# EasyEDA Pro project ProDoc_发射端.epro

# Schematic Main

## Sheets
1 P2: Board Name: 发射端; Create Date: 2025-08-19; Page Name: P2; Project Name: thu硬设魔杖; Schematic Name: Main; Update Date: 2025-08-24; Company: 嘉立创EDA; Page Size: A4; Version: V1.0
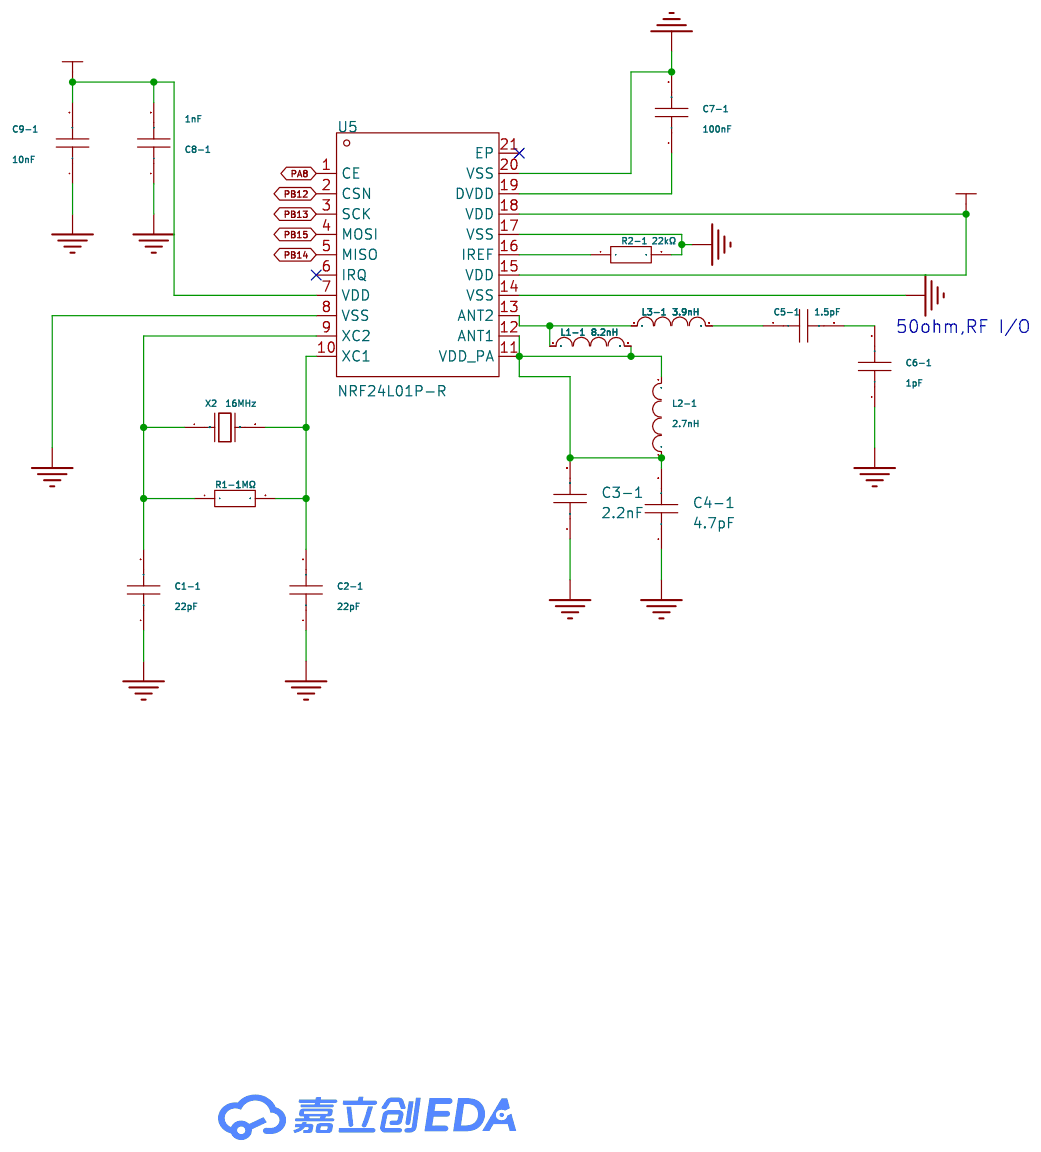
[diagram p0: P2]
2 P3: Board Name: Main; Create Date: 2025-08-20; Page Name: P3; Update Date: 2025-08-22
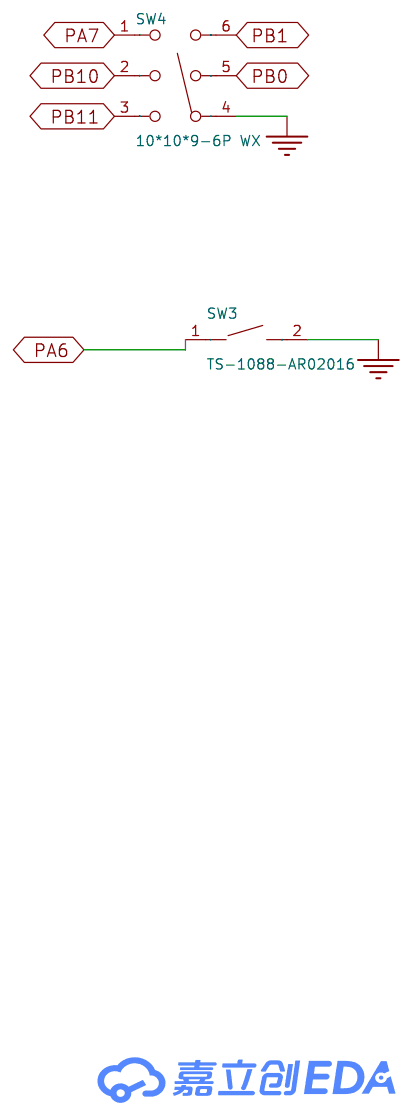
[diagram p1: P3]
3 P1: Create Date: 2025-08-20; Page Name: P1; Update Date: 2025-08-29
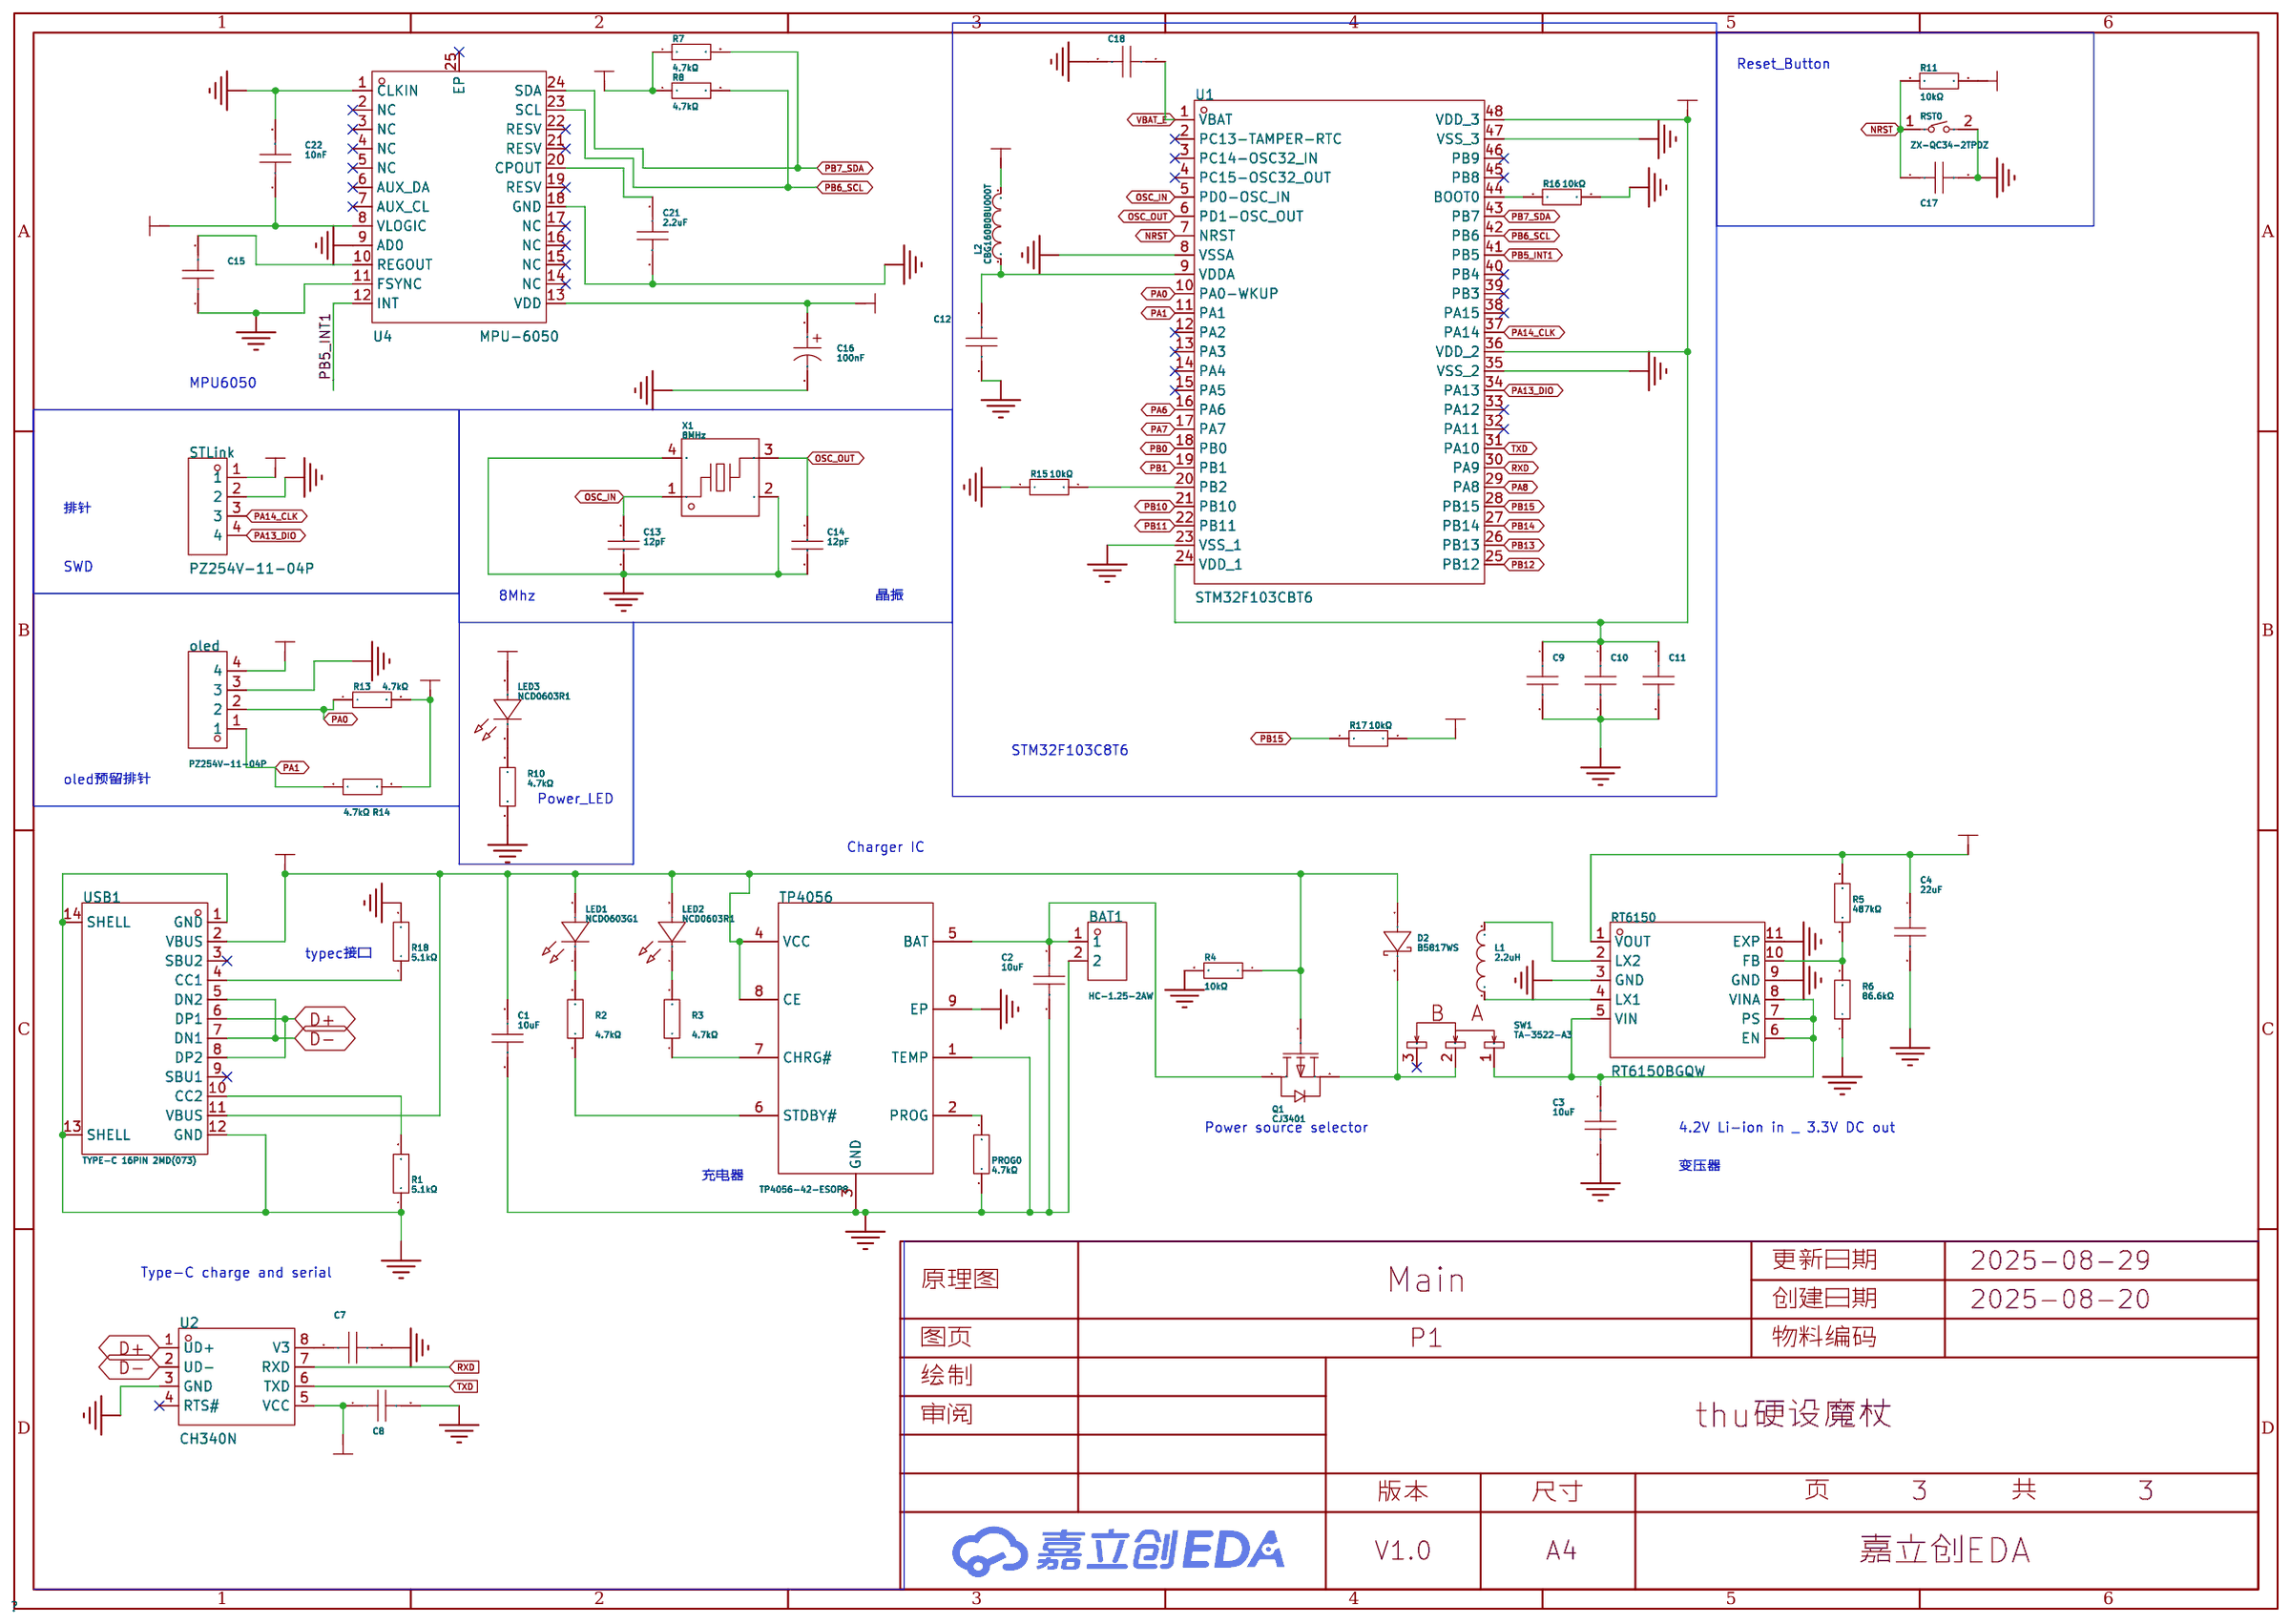
[diagram p2: P1]

## Parts
sheet P1
BAT1  HC-1.25-2AW  [CONN-TH_2P-P1.25_HCTL_HC-1.25-2AW]
C1  10uF  [C0603]
C2  10uF  [C0603]
C3  10uF  [C0603]
C4  22uF  [C0603]
C7  100nF  [C0603]
C8  100nF  [C0603]
C9  100nF  [C0603]
C10  100nF  [C0603]
C11  100nF  [C0603]
C12  100nF  [C0603]
C13  12pF  [C0603]
C14  12pF  [C0603]
C15  100nF  [C0603]
C16  100nF  [C0603]
C17  100nF  [C0603]
C18  100nF  [C0603]
C21  2.2uF  [C0603]
C22  10nF  [C0603]
D2  B5817WS  [SOD-323_L1.7-W1.3-LS2.5-FD]
L1  2.2uH  [L0603]
L2  CBG160808U000T  [L0603]
LED1  NCD0603G1  [LED0603-RD_1]
LED2  NCD0603R1  [LED0603-RD_RED]
LED3  NCD0603R1  [LED0603-RD_RED]
oled  PZ254V-11-04P  [HDR-TH_4P-P2.54-V-M]
PROG0  4.7kΩ  [R0603]
Q1  CJ3401  [SOT-23-3_L2.9-W1.6-P1.90-LS2.8-BR]
R1  5.1kΩ  [R0603]
R2  4.7kΩ  [R0603]
R3  4.7kΩ  [R0603]
R4  10kΩ  [R0603]
R5  487kΩ  [R0603]
R6  86.6kΩ  [R0603]
R7  4.7kΩ  [R0603]
R8  4.7kΩ  [R0603]
R10  4.7kΩ  [R0603]
R11  10kΩ  [R0603]
R13  4.7kΩ  [R0603]
R14  4.7kΩ  [R0603]
R15  10kΩ  [R0603]
R16  10kΩ  [R0603]
R17  10kΩ  [R0603]
R18  5.1kΩ  [R0603]
RST0  ZX-QC34-2TPDZ  [KEY-SMD_L3.9-W3.0-LS5.0-EH]
RT6150  RT6150BGQW  [WSON-10_L2.5-W2.5-P0.50-BL-EP]
STLink  PZ254V-11-04P  [HDR-TH_4P-P2.54-V-M]
SW1  TA-3522-A3  [SW-TH_3P-L9.1-W3.5-P2.50-A3]
TP4056  TP4056-42-ESOP8  [ESOP-8_L4.9-W3.9-P1.27-LS6.0-BL-EP]
U1  STM32F103CBT6  [LQFP-48_L7.0-W7.0-P0.50-LS9.0-BL]
U2  CH340N  [SOP-8_L4.9-W3.9-P1.27-LS6.0-BL]
U4  MPU-6050  [QFN-24_L4.0-W4.0-P0.50-BL-EP2.7]
USB1  TYPE-C 16PIN 2MD(073)  [USB-C-SMD_TYPE-C-6PIN-2MD-073]
X1  8MHz  [CRYSTAL-SMD_4P-L3.2-W2.5-BL]
sheet P2
C1-1  22pF  [C0603]
C2-1  22pF  [C0603]
C3-1  2.2nF  [C0603]
C4-1  4.7pF  [C0603]
C5-1  1.5pF  [C0603]
C6-1  1pF  [C0603]
C7-1  100nF  [C0603]
C8-1  1nF  [C0603]
C9-1  10nF  [C0603]
L1-1  8.2nH  [L0603]
L2-1  2.7nH  [L0603]
L3-1  3.9nH  [L0603]
R1-1  1MΩ  [R0603]
R2-1  22kΩ  [R0603]
U5  NRF24L01P-R  [QFN-20_L4.0-W4.0-P0.50-BL-EP]
X2  16MHz  [OSC-TH_L10.0-W4.5-P5.00]
sheet P3
SW3  TS-1088-AR02016  [SW-SMD_L3.9-W3.0-P4.45]
SW4  10*10*9-6P WX  [SW-SMD-6P-L10.5-W10.0_C2858290]

## Library data of the parts
BAT1 = HC-1.25-2AW: 插针结构:1x2P;间距:1.25mm;安装方式:弯插;参考系列:-;总PIN数:2P;排数:1;每排PIN数:2;行距:-;额定电流:1A;触头材质:黄铜;触头镀层:锡;工作温度范围:-25℃~+85℃;; LCSC Part Name: 1x2P 间距:1.25mm 弯插; Supplier Part: C2845535; Manufacturer: HCTL(华灿天禄); Supplier Footprint: 弯插,P=1.25mm; JLCPCB Part Class: 扩展库; Datasheet: https://atta.szlcsc.com/upload/public/pdf/source/20230707/04F6BEA69F699E7BB6558EF06AF1DC24.pdf; Supplier: LCSC; Pins Structure: 1x2P; Pitch: 1.25mm; Mounting Style: 弯插; Number of Pins: 2P; Number of Rows: 1; Number of PINs Per Row: 2; Current Rating (Max): 1A; Contact Material: 黄铜; Contact Plating: 锡; Operating Temperature Range: -25℃~+85℃
C1-C3 = CL10A106KP8NNNC: 容值:10uF;精度:±10%;额定电压:10V;温度系数:X5R;; LCSC Part Name: 10uF ±10% 10V; Supplier Part: C19702; Manufacturer: SAMSUNG(三星); Supplier Footprint: 0603; JLCPCB Part Class: Basic Part; Datasheet: https://item.szlcsc.com/datasheet/CL10A106KP8NNNC/20411.html; Supplier: LCSC; Tolerance: ±10%; Voltage Rating: 10V; Temperature Coefficient: X5R
C4 = CL10A226MO7JZNC: 容值:22uF;精度:±20%;额定电压:16V;温度系数:X5R;; LCSC Part Name: 22uF ±20% 16V; Supplier Part: C2762594; Manufacturer: SAMSUNG(三星); Supplier Footprint: 0603; JLCPCB Part Class: Extended Part; Datasheet: https://item.szlcsc.com/datasheet/CL10A226MO7JZNC/2889856.html; Supplier: LCSC; Tolerance: ±20%; Voltage Rating: 16V; Temperature Coefficient: X5R
C7-C12 C15 C17 C18 = CT41G-0603-2X1-50V-0.1μF-K(N): 容值:100nF;精度:±10%;额定电压:50V;温度系数:-;; LCSC Part Name: 100nF ±10% 50V; Supplier Part: C125205; Manufacturer: TORCH(火炬); Supplier Footprint: 0603; JLCPCB Part Class: Extended Part; Datasheet: https://atta.szlcsc.com/upload/public/pdf/source/20171225/C150708_15141883600121203188.pdf; Supplier: LCSC; Tolerance: ±10%; Voltage Rating: 50V
C13 C14 = CL10C120JB8NNNC: 容值:12pF;精度:±5%;额定电压:50V;温度系数:C0G;; LCSC Part Name: 12pF ±5% 50V; Supplier Part: C38523; Manufacturer: SAMSUNG(三星); Supplier Footprint: 0603; JLCPCB Part Class: Basic Part; Datasheet: https://item.szlcsc.com/datasheet/CL10C120JB8NNNC/39506.html; Supplier: LCSC; Tolerance: ±5%; Voltage Rating: 50V; Temperature Coefficient: C0G
C7-1 C16 = CGA0603X7R104K500JT: 容值:100nF;精度:±10%;额定电压:50V;温度系数:X7R;; LCSC Part Name: 100nF ±10% 50V; Supplier Part: C6119867; Manufacturer: HRE(芯声); Supplier Footprint: 0603; JLCPCB Part Class: Extended Part; Datasheet: https://atta.szlcsc.com/upload/public/pdf/source/20250103/C44077DA9E7B3EFAE02F22B6D3D1CBC9.pdf; Supplier: LCSC; Tolerance: ±10%; Voltage Rating: 50V; Temperature Coefficient: X7R
C21 = CL10A225KO8NNNC: 容值:2.2uF;精度:±10%;额定电压:16V;材质(温度系数):X5R;; LCSC Part Name: 2.2uF ±10% 16V; Supplier Part: C23630; Manufacturer: SAMSUNG(三星); Supplier Footprint: 0603; JLCPCB Part Class: Basic Part; Datasheet: https://atta.szlcsc.com/upload/public/pdf/source/20160218/1457707763339.pdf; Supplier: LCSC; Tolerance: ±10%; Voltage Rated: 16V; Temperature Coefficient: X5R
C22 = CC0603KRX7R9BB103: 容值:10nF;精度:±10%;额定电压:50V;材质(温度系数):X7R;; LCSC Part Name: 10nF ±10% 50V; Supplier Part: C100042; Manufacturer: YAGEO(国巨); Supplier Footprint: 0603; JLCPCB Part Class: Extended Part; Datasheet: https://atta.szlcsc.com/upload/public/pdf/source/20181008/C309510_22F155564471FAF6A489F7D68F34234E.pdf; Supplier: LCSC; Tolerance: ±10%; Voltage Rated: 50V; Temperature Coefficient: X7R
D2 = B5817WS_C7420329: 二极管配置:独立式;正向压降(Vf):450mV@1.0A;直流反向耐压(Vr):20V;整流电流:1A;; LCSC Part Name: 电压:20V 电流:1A; Supplier Part: C7420329; Manufacturer: 宏嘉诚; Supplier Footprint: SOD-323; JLCPCB Part Class: Extended Part; Datasheet: https://item.szlcsc.com/datasheet/B5817WS/8397151.html; Supplier: LCSC; Diode Configuration: 独立式; Forward Voltage (Vf@If): 450mV@1.0A; Reverse Voltage (Vr): 20V; Average Rectified Current (Io): 1A; Reverse Leakage Current (Ir): 1mA@20V; Voltage - Forward(Vf@If): 450mV@1.0A; Voltage - DC Reverse(Vr): 20V; Current - Rectified: 1A; Operating Junction Temperature Range: -55℃~+150℃; Non-Repetitive Peak Forward Surge Current: 10A
L1 = CMH160808B2R2MT: 电感值:2.2uH;精度:±20%;额定电流:750mA;; LCSC Part Name: 2.2uH ±20%; Supplier Part: C394950; Manufacturer: FH(风华); Supplier Footprint: 0603; JLCPCB Part Class: Extended Part; Datasheet: https://atta.szlcsc.com/upload/public/pdf/source/20230223/142B566F7A79878A07A1E031813F1064.pdf; Supplier: LCSC; Tolerance: ±20%; Current Rating: 750mA; DC Resistance(DCR): 240mΩ; Ratings: AEC-Q200
L2 = CBG160808U000T: 标称阻抗@测试频率:0Ω@100MHz;直流电阻(RDC):100mΩ;; LCSC Part Name: 单路 0603磁珠 阻抗0Ω@100MHz; Supplier Part: C43163; Manufacturer: FH(风华); Supplier Footprint: 0603; JLCPCB Part Class: 扩展库; Datasheet: https://atta.szlcsc.com/upload/public/pdf/source/20190129/C361667_1614D407CC98D1D3CFBD9E1F7511C14D.pdf; Supplier: LCSC; Impedance @ Frequency: 0Ω@100MHz; DC Resistance: 100mΩ; Current Rating: 800mA; Circuits: 1
LED1 = NCD0603G1: 发光颜色:翠绿色;正向压降(Vf):2.6V~3.6V;功率:72mW;正向电流:20mA;波长:515nm~530nm;透镜颜色:-;发光强度:330mcd~900mcd;发光角度:130°;工作温度:-30℃~+85℃;; Supplier Part: C84267; Manufacturer: 国星光电; Supplier Footprint: 0603; JLCPCB Part Class: Extended Part; Datasheet: https://item.szlcsc.com/datasheet/NCD0603G1/85436.html; Supplier: LCSC; Illumination Color: 翠绿色; Voltage - Forward(Vf): 2.6V~3.6V; Power(Watts): 72mW; Forward Current: 20mA; Wavelength - Dominant: 515nm~530nm; Luminous Intensity: 330mcd~900mcd; Viewing Angle: 130°; Operating Temperature: -30℃~+85℃
LED2 LED3 = NCD0603R1_C84263: 灯头类型:-;发光颜色:红色;正向电压(VF):1.6V~2.6V;功率:65mW;正向电流:20mA;主波长:615nm~630nm;二极管配置:独立二极管;透镜颜色:无色透明透镜;色温:-;发光强度:80mcd~220mcd;发光角度:130°;载带方式:-;工作温度:-30℃~+85℃;; Supplier Part: C84263; Manufacturer: 国星光电; Supplier Footprint: 0603; JLCPCB Part Class: Extended Part; Datasheet: https://atta.szlcsc.com/upload/public/pdf/source/20200820/C84263_DABC6A75E58F576973B407FDBA283D60.pdf; Supplier: LCSC; Emitted Color: 红色; Forward Voltage (VF): 1.6V~2.6V; Power Dissipation: 65mW; Forward Current: 20mA; Dominant Wavelength: 615nm~630nm; Diode Configuration: 独立二极管; Lens Color: 无色透明透镜; Luminous Intensity: 80mcd~220mcd; Viewing Angle: 130°; Operating Temperature: -30℃~+85℃
oled STLink = PZ254V-11-04P: 插针结构:1x4P;间距:2.54mm;行距:-;圆针/方针:方针;安装类型:直插;排数:单排;总PIN位数:4P;额定电流:3A;额定电压:250V;配合针长度:6mm;塑高:2.5mm;端接针长度:3mm;触头材质:-;工作温度范围:-40℃~+105℃;颜色:黑色;; LCSC Part Name: 间距:2.54mm 1x4P 直插 方针; Supplier Part: C2691448; Manufacturer: XFCN(兴飞); Supplier Footprint: 插件,P=2.54mm; JLCPCB Part Class: 扩展库; Datasheet: https://atta.szlcsc.com/upload/public/pdf/source/20200309/C492403_F9F19131791D08044AD4F84F8E751A34.pdf; Supplier: LCSC; Pin Structure: 1x4P; Pitch: 2.54mm; Circluar Pins/Square Pins: 方针; Mounting Type: 直插; Number of Rows: 单排; Number of Pins: 4P; Current Rating (Max): 3A; Voltage Rating (Max): 250V; Length of Mating Pin: 6mm; Insulation Height: 2.5mm; Length of End Connection Pin: 3mm; Operating Temperature Range: -40℃~+105℃; Color: 黑色
PROG0 R2 R3 R7 R8 R10 R13 R14 = 0603WAF4701T5E: 电阻类型:厚膜电阻;阻值:4.7kΩ;精度:±1%;功率:100mW;工作电压:75V;温度系数:±100ppm/℃;; LCSC Part Name: 4.7kΩ ±1% 100mW 厚膜电阻; Supplier Part: C23162; Manufacturer: UNI-ROYAL(厚声); Supplier Footprint: 0603; JLCPCB Part Class: Basic Part; Datasheet: https://item.szlcsc.com/datasheet/0603WAF4701T5E/23889.html; Supplier: LCSC; Type: 厚膜电阻; Tolerance: ±1%; Power(Watts): 100mW; Voltage-Supply(Max): 75V; Temperature Coefficient: ±100ppm/℃; Operating Temperature: -55℃~+155℃
Q1 = CJ3401: 类型:1个P沟道;漏源电压(Vdss):30V;连续漏极电流(Id):4.2A;功率(Pd):350mW;导通电阻(RDS(on)@Vgs,Id):65mΩ@10V,4.2A;阈值电压(Vgs(th)@Id):1.3V@250uA;; LCSC Part Name: 1个P沟道 耐压:30V 电流:4.2A; Supplier Part: C13799; Manufacturer: CJ(江苏长电/长晶); Supplier Footprint: SOT-23; JLCPCB Part Class: 扩展库; Datasheet: https://atta.szlcsc.com/upload/public/pdf/source/20140815/1457707217656.pdf; Supplier: LCSC; Type: 1个P沟道; Drain Source Voltage (Vdss): 30V; Continuous Drain Current (Id): 4.2A; Power Dissipation (Pd): 350mW; Drain Source On Resistance (RDS(on)@Vgs,Id): 65mΩ@10V,4.2A; Gate Threshold Voltage (Vgs(th)@Id): 1.3V@250uA
R1 R18 = 0603WAF5101T5E: 电阻类型:厚膜电阻;阻值:5.1kΩ;精度:±1%;功率:100mW;工作电压:75V;温度系数:±100ppm/℃;; LCSC Part Name: 5.1kΩ ±1% 100mW 厚膜电阻; Supplier Part: C23186; Manufacturer: UNI-ROYAL(厚声); Supplier Footprint: 0603; JLCPCB Part Class: Basic Part; Datasheet: https://item.szlcsc.com/datasheet/0603WAF5101T5E/23913.html; Supplier: LCSC; Type: 厚膜电阻; Tolerance: ±1%; Power(Watts): 100mW; Voltage-Supply(Max): 75V; Temperature Coefficient: ±100ppm/℃; Operating Temperature: -55℃~+155℃
R4 R11 = 0603WAF1002T5E: 电阻类型:厚膜电阻;阻值:10kΩ;精度:±1%;功率:100mW;工作电压:75V;温度系数:±100ppm/℃;; LCSC Part Name: 厚膜电阻 10kΩ ±1% 100mW; Supplier Part: C25804; Manufacturer: UNI-ROYAL(厚声); Supplier Footprint: 0603; JLCPCB Part Class: Basic Part; Datasheet: https://item.szlcsc.com/datasheet/0603WAF1002T5E/26547.html; Supplier: LCSC; Type: 厚膜电阻; Tolerance: ±1%; Power(Watts): 100mW; Overload Voltage (Max): 75V; Temperature Coefficient: ±100ppm/℃; Operating Temperature Range: -55℃~+155℃; Voltage-Supply(Max): 75V; Operating Temperature: -55℃~+155℃
R5 = ERJ3EKF4873V: 电阻类型:厚膜电阻;阻值:487kΩ;精度:±1%;功率:100mW;工作电压:150V;温度系数:±100ppm/℃;; LCSC Part Name: 487kΩ ±1% 100mW 厚膜电阻; Supplier Part: C403250; Manufacturer: PANASONIC(松下); Supplier Footprint: 0603; JLCPCB Part Class: Extended Part; Datasheet: https://item.szlcsc.com/datasheet/ERJ3EKF4873V/389049.html; Supplier: LCSC; Type: 厚膜电阻; Tolerance: ±1%; Power(Watts): 100mW; Voltage-Supply(Max): 150V; Temperature Coefficient: ±100ppm/℃; Operating Temperature: -55℃~+155℃
R6 = RT0603BRD0786K6L: 电阻类型:薄膜电阻;阻值:86.6kΩ;精度:±0.1%;功率:100mW;温度系数:±25ppm/℃;; LCSC Part Name: 薄膜电阻 86.6kΩ ±0.1% 100mW; Supplier Part: C861580; Manufacturer: YAGEO(国巨); Supplier Footprint: 0603; JLCPCB Part Class: Extended Part; Datasheet: https://atta.szlcsc.com/upload/public/pdf/source/20200610/C326738_5639A9F1B6EB6E4AE2197577D3456E7F.pdf; Supplier: LCSC; Type: 薄膜电阻; Tolerance: ±0.1%; Power(Watts): 100mW; Temperature Coefficient: ±25ppm/℃; Operating Temperature Range: -55℃~+155℃
R15-R17 = 0603WAF1002T5E: 电阻类型:厚膜电阻;阻值:10kΩ;精度:±1%;功率:100mW;工作电压:75V;温度系数:±100ppm/℃;; LCSC Part Name: 厚膜电阻 10kΩ ±1% 100mW; Supplier Part: C25804; Manufacturer: UNI-ROYAL(厚声); Supplier Footprint: 0603; JLCPCB Part Class: 基础库; Datasheet: https://atta.szlcsc.com/upload/public/pdf/source/20200306/C422600_1E6D84923E4A46A82E41ADD87F860B5C.pdf; Supplier: LCSC; Type: 厚膜电阻; Tolerance: ±1%; Power(Watts): 100mW; Overload Voltage (Max): 75V; Temperature Coefficient: ±100ppm/℃; Operating Temperature Range: -55℃~+155℃; Voltage-Supply(Max): 75V; Operating Temperature: -55℃~+155℃
RST0 = ZX-QC34-2TPDZ: 电路结构:单刀单掷;按钮形状:圆形按钮;作用力:2.6N;安装方式:立贴;开关长度:3mm;开关宽度:4mm;开关高度:2mm;带支架:不带;触点电流:50mA;额定电压(AC):250V;额定电压(DC):12V;绝缘电阻:100MΩ;机械寿命:10万次;; LCSC Part Name: 3*4*2贴片开关带柱; Supplier Part: C7470219; Manufacturer: Megastar(兆星); Supplier Footprint: SMD; JLCPCB Part Class: 扩展库; Datasheet: https://atta.szlcsc.com/upload/public/pdf/source/20230724/D2731FAADF93973E25928DE23F241F8A.pdf; Supplier: LCSC; Circuit: 单刀单掷; Actuator Style: 圆形按钮; Operating Force: 2.6N; Mounting Style: 立贴; Switch Length: 3mm; Switch Width: 4mm; Switch Height: 2mm; Strike Gundam: 不带; Contact Current: 50mA; Voltage Rating (AC): 250V; Voltage Rating (DC): 12V; Insulation Resistance: 100MΩ; Actuator/Cap Color: 黑色; Pin Style: 鸥翼型; Mechanical Life: 10万次; Operating Temperature: -30℃~+80℃
RT6150 = RT6150BGQW: 功能类型:升降压型;输入电压:1.8V~5.5V;输出电压:1.8V~5.5V;输出电流(最大值):800mA;; Supplier Part: C147972; Manufacturer: RICHTEK(立锜); Supplier Footprint: WSON-10-EP(2.5x2.5); JLCPCB Part Class: 扩展库; Datasheet: https://atta.szlcsc.com/upload/public/pdf/source/20180126/C147972_15169561259341309260.pdf; Supplier: LCSC; Function: 升降压型; Input Voltage: 1.8V~5.5V; Output Voltage: 1.8V~5.5V; Output Current (Max): 800mA; Switching Frequency: 1MHz; Synchronous Rectification: 是; Number of Outputs: 1; Topology: 降压-升压式; Switch tube (built-in/external): 内置
SW1 = TA-3522-A3: LCSC Part Name: 滑动开关9.1*3.5*4.0mm插件侧拨三脚二档; Supplier Part: C514011; Manufacturer: Yuandi(元迪); Supplier Footprint: 插件-3P,3.5x9.1mm,弯插; JLCPCB Part Class: 扩展库; Datasheet: https://atta.szlcsc.com/upload/public/pdf/source/20200415/C514009_6EED03F5D6F9885D6506BA57997A5078.pdf; Supplier: LCSC
TP4056 = TP4056-42-ESOP8: 锂电池充电芯片 42代表电池满电电压4.2V。; Supplier Part: C16581; Manufacturer: TOPPOWER(南京拓微); Supplier Footprint: ESOP-8; JLCPCB Part Class: 扩展库; Datasheet: https://atta.szlcsc.com/upload/public/pdf/source/20190626/C16581_611BCF5D7CF554EAE465137A8F68DB3E.pdf; Supplier: LCSC
U1 = STM32F103CBT6: CPU内核:ARM-M3;CPU最大主频:72MHz;应用领域:-;; LCSC Part Name: 主流增强型ARM Cortex-M3 MCU，具有128 KB Flash、72 MHz CPU、电机控制、USB和CAN; Supplier Part: C8304; Manufacturer: ST(意法半导体); Supplier Footprint: LQFP-48(7x7); JLCPCB Part Class: Extended Part; Datasheet: https://atta.szlcsc.com/upload/public/pdf/source/20150811/1457707344439.pdf; Supplier: LCSC; CPU Core: ARM-M3; CPU Maximum Speed: 72MHz; Program Storage Size: 128KB; Program Memory Type: FLASH; Number of I/O: 37; ADC (Bit): 12bit; Voltage - Supply: 2V~3.6V; 16Bit Timer: 3; CAN: 1; UART/USART: 3; I2C: 2; SPI: 3
U2 = CH340N: LCSC Part Name: USB转串口芯片 CH340; Supplier Part: C2977777; Manufacturer: WCH(南京沁恒); Supplier Footprint: SOP-8; JLCPCB Part Class: 扩展库; Datasheet: https://atta.szlcsc.com/upload/public/pdf/source/20230530/6E401E9554E9F5311886CC8B3F89B62E.pdf; Supplier: LCSC
U4 = MPU-6050: 传感器类型:加速度计陀螺仪;; Supplier Part: C24112; Manufacturer: TDK InvenSense(应美盛); Supplier Footprint: QFN-24-EP(4x4); JLCPCB Part Class: 扩展库; Datasheet: https://atta.szlcsc.com/upload/public/pdf/source/20140425/1457707046159.pdf; Supplier: LCSC; Sensor Type: 加速度计陀螺仪; Operating Temperature: -40℃~+85℃
USB1 = TYPE-C 16PIN 2MD(073): 连接器类型:Type-C;标准:-;公母:母;端口数量:1;触点数量:16P;安装方式:卧贴;额定电流 - 电源:5A;工作温度范围:-25℃~+85℃;; LCSC Part Name: Type-C 母 卧贴; Supplier Part: C2765186; Manufacturer: SHOU HAN(首韩); Supplier Footprint: SMD; JLCPCB Part Class: Extended Part; Datasheet: https://atta.szlcsc.com/upload/public/pdf/source/20211123/39B17C16241EAC15C5E277BDA434118E.pdf; Supplier: LCSC; Connector Type: Type-C; Gender: 母; Number of Ports: 1; Number of Contacts: 16P; Mounting Style: 卧贴; Current Rating - Power (Max): 5A; Operating Temperature Range: -25℃~+85℃
X1 = X32258MOB4SI: 晶振类型:贴片晶振;频率:8MHz;常温频差:±10ppm;负载电容:12pF;频率稳定度:±20ppm;; LCSC Part Name: YSX321SL 8MHZ 4P 3225 12PF ±10PPM -40~85℃ (±20PPM); Supplier Part: C2682775; Manufacturer: YXC(扬兴晶振); Supplier Footprint: SMD3225-4P; JLCPCB Part Class: Extended Part; Datasheet: https://item.szlcsc.com/datasheet/X32258MOB4SI/2777872.html; Supplier: LCSC; Type: 贴片晶振; Normal temperature Frequency Tolerance: ±10ppm; Load Capacitance: 12pF; Frequency Stability: ±20ppm; Equivalent Series Resistance(ESR): 150Ω; Operating Temperature: -40℃~+85℃
C1-1 C2-1 = CL10C220JB8NNNC: 容值:22pF;精度:±5%;额定电压:50V;温度系数:C0G;; LCSC Part Name: 22pF ±5% 50V; Supplier Part: C1653; Manufacturer: SAMSUNG(三星); Supplier Footprint: 0603; JLCPCB Part Class: Basic Part; Datasheet: https://item.szlcsc.com/datasheet/CL10C220JB8NNNC/2005.html; Supplier: LCSC; Tolerance: ±5%; Voltage Rating: 50V; Temperature Coefficient: C0G
C3-1 = FCC0603B222K500CT: 容值:2.2nF;精度:±10%;额定电压:50V;温度系数:X7R;; LCSC Part Name: 2.2nF ±10% 50V; Supplier Part: C5137562; Manufacturer: FOJAN(富捷); Supplier Footprint: 0603; JLCPCB Part Class: Extended Part; Datasheet: https://atta.szlcsc.com/upload/public/pdf/source/20220818/0EB3B7FB2F5648AC16609637FBA7DABE.pdf; Supplier: LCSC; Tolerance: ±10%; Voltage Rating: 50V; Temperature Coefficient: X7R
C4-1 = 0603CG4R7C500NT: 容值:4.7pF;额定电压:50V;材质(温度系数):C0G;; LCSC Part Name: 4.7pF 50V; Supplier Part: C1669; Manufacturer: FH(风华); Supplier Footprint: 0603; JLCPCB Part Class: Extended Part; Datasheet: https://atta.szlcsc.com/upload/public/pdf/source/20200305/C486355_26A10D38EF8C2A5C37091D0039909270.pdf; Supplier: LCSC; Voltage Rated: 50V; Temperature Coefficient: C0G
C5-1 = 0603CG1R5C500NT: 容值:1.5pF;额定电压:50V;温度系数:C0G;; LCSC Part Name: ±0.25pF 1.5pF 50V; Supplier Part: C1639; Manufacturer: FH(风华); Supplier Footprint: 0603; JLCPCB Part Class: Extended Part; Datasheet: https://atta.szlcsc.com/upload/public/pdf/source/20200305/C486355_26A10D38EF8C2A5C37091D0039909270.pdf; Supplier: LCSC; Voltage Rating: 50V; Temperature Coefficient: C0G
C6-1 = 0603CG1R0C500NT: 容值:1pF;额定电压:50V;材质(温度系数):C0G;; LCSC Part Name: 1pF 50V; Supplier Part: C37117; Manufacturer: FH(风华); Supplier Footprint: 0603; JLCPCB Part Class: Extended Part; Datasheet: https://atta.szlcsc.com/upload/public/pdf/source/20200305/C486355_26A10D38EF8C2A5C37091D0039909270.pdf; Supplier: LCSC; Voltage Rated: 50V; Temperature Coefficient: C0G
C8-1 = CL10B102KB8NNNC: 容值:1nF;精度:±10%;额定电压:50V;温度系数:X7R;; LCSC Part Name: 1nF ±10% 50V; Supplier Part: C1588; Manufacturer: SAMSUNG(三星); Supplier Footprint: 0603; JLCPCB Part Class: Basic Part; Datasheet: https://item.szlcsc.com/datasheet/CL10B102KB8NNNC/1940.html; Supplier: LCSC; Tolerance: ±10%; Voltage Rating: 50V; Temperature Coefficient: X7R
C9-1 = 0603B103K500NT: 容值:10nF;精度:±10%;额定电压:50V;温度系数:X7R;; LCSC Part Name: 10nF ±10% 50V; Supplier Part: C57112; Manufacturer: FH(风华); Supplier Footprint: 0603; JLCPCB Part Class: Basic Part; Datasheet: https://atta.szlcsc.com/upload/public/pdf/source/20200305/C486355_26A10D38EF8C2A5C37091D0039909270.pdf; Supplier: LCSC; Tolerance: ±10%; Voltage Rating: 50V; Temperature Coefficient: X7R
L1-1 = LQG18HN8N2J00D: 电感值:8.2nH;精度:±5%;额定电流:800mA;饱和电流(Isat):-;直流电阻(DCR):200mΩ;; LCSC Part Name: 8.2nH ±5%; Supplier Part: C98009; Manufacturer: muRata(村田); Supplier Footprint: 0603; JLCPCB Part Class: Extended Part; Datasheet: https://atta.szlcsc.com/upload/public/pdf/source/20180326/C98009_7046A2592ACD2B033EC7793A778D5AE4.pdf; Supplier: LCSC; Tolerance: ±5%; Rated Current: 800mA; DC Resistance (DCR): 200mΩ; Q @ Freq: 12@100MHz; Frequency - Self Resonant: 4GHz
L2-1 = SCC1608C2N7SSP: 电感值:2.7nH;额定电流:500mA;饱和电流(Isat):-;直流电阻(DCR):200mΩ;; Supplier Part: C412027; Manufacturer: Sunltech(顺磁); Supplier Footprint: 0603; JLCPCB Part Class: Extended Part; Datasheet: https://atta.szlcsc.com/upload/public/pdf/source/20190819/C412052_7E47CA9107AD18C13168C896A90007C8.pdf; Supplier: LCSC; Current Rating: 500mA; DC Resistance(DCR): 200mΩ
L3-1 = SDCL1608C3N9STDF: 电感值:3.9nH;精度:-;额定电流:500mA;饱和电流(Isat):-;直流电阻(DCR):160mΩ;; LCSC Part Name: 3.9nH ±0.3nH; Supplier Part: C13818; Manufacturer: Sunlord(顺络); Supplier Footprint: 0603; JLCPCB Part Class: Extended Part; Datasheet: https://atta.szlcsc.com/upload/public/pdf/source/20231027/6126A3AAC5912C34388756BE22DEE00C.pdf; Supplier: LCSC; Rated Current: 500mA; DC Resistance(DCR): 160mΩ; Q @ Frequency: 10@100MHz; Frequency - Self Resonant: 6GHz
R1-1 = 0603WAF1004T5E: 电阻类型:厚膜电阻;阻值:1MΩ;精度:±1%;功率:100mW;最大工作电压:75V;温度系数:±100ppm/℃;; LCSC Part Name: 1MΩ ±1% 100mW 厚膜电阻; Supplier Part: C22935; Manufacturer: UNI-ROYAL(厚声); Supplier Footprint: 0603; JLCPCB Part Class: Basic Part; Datasheet: https://atta.szlcsc.com/upload/public/pdf/source/20200306/C422600_1E6D84923E4A46A82E41ADD87F860B5C.pdf; Supplier: LCSC; Type: 厚膜电阻; Tolerance: ±1%; Power(Watts): 100mW; Overload Voltage (Max): 75V; Temperature Coefficient: ±100ppm/℃; Operating Temperature Range: -55℃~+155℃
R2-1 = 0603WAF2202T5E: 电阻类型:厚膜电阻;阻值:22kΩ;精度:±1%;功率:100mW;最大工作电压:75V;温度系数:±100ppm/℃;; LCSC Part Name: 22kΩ ±1% 100mW 厚膜电阻; Supplier Part: C31850; Manufacturer: UNI-ROYAL(厚声); Supplier Footprint: 0603; JLCPCB Part Class: Basic Part; Datasheet: https://atta.szlcsc.com/upload/public/pdf/source/20200306/C422600_1E6D84923E4A46A82E41ADD87F860B5C.pdf; Supplier: LCSC; Type: 厚膜电阻; Tolerance: ±1%; Power(Watts): 100mW; Overload Voltage (Max): 75V; Temperature Coefficient: ±100ppm/℃; Operating Temperature Range: -55℃~+155℃
U5 = NRF24L01P-R: 频率范围:2.4GHz~2.525GHz;接口类型:SPI;应用领域:-;数据速率:2Mbps;灵敏度:-82dBm;典型应用频率:2.4GHz;; LCSC Part Name: 单芯片2.4GHz收发器; Supplier Part: C8791; Manufacturer: NORDIC; Supplier Footprint: QFN-20-EP(4x4); JLCPCB Part Class: Extended Part; Datasheet: https://atta.szlcsc.com/upload/public/pdf/source/20120816/1457706530106.pdf; Supplier: LCSC; Frequency Range: 2.4GHz~2.525GHz; Interface: SPI; Voltage - Supply: 1.9V~3.6V; Output Power: 0dBm; Data Rate: 2Mbps; Current Of Transmitting: 11.3mA; Sensitivity: -82dBm; Receive Current: 13.5mA; Typical Application Frequency: 2.4GHz; Operating Temperature: -40℃~+85℃
X2 = X49SD16MSD2SC: 晶振类型:直插晶振;频率:16MHz;常温频差:±20ppm;负载电容:20pF;频率稳定度:±30ppm;; LCSC Part Name: HC-49US 16MHZ 2P 49S 20PF ±20PPM -20~70℃ (±30PPM); Supplier Part: C16212; Manufacturer: YXC(扬兴晶振); Supplier Footprint: HC-49S; JLCPCB Part Class: Extended Part; Datasheet: https://atta.szlcsc.com/upload/public/pdf/source/20240329/977D7F2434F98B2BE33270BB9FF3D86D.pdf; Supplier: LCSC; Type: 直插晶振; Normal temperature Frequency Tolerance: ±20ppm; Load Capacitance: 20pF; Frequency Stability: ±30ppm; Operating Temperature: -20℃~+70℃
SW3 = TS-1088-AR02016: 电路结构:单刀单掷;按钮形状:圆形按钮;作用力:160gf;安装方式:立贴;开关长度:4mm;开关宽度:3mm;开关高度:2mm;带支架:不带;触点电流:50mA;额定电压(DC):12V;绝缘电阻:100MΩ;机械寿命:10万次;; LCSC Part Name: 4*3*2mm 立贴 轻触开关; Supplier Part: C720477; Manufacturer: XUNPU(讯普); Supplier Footprint: SMD; JLCPCB Part Class: 基础库; Datasheet: https://atta.szlcsc.com/upload/public/pdf/source/20200810/C720475_60D09DD6C54279ADDB2DC25100F1CC11.pdf; Supplier: LCSC; Circuit: 单刀单掷; Actuator Style: 圆形按钮; Operating Force: 160gf; Mounting Style: 立贴; Switch Length: 4mm; Switch Width: 3mm; Switch Height: 2mm; Strike Gundam: 不带; Contact Current: 50mA; Voltage Rating (DC): 12V; Insulation Resistance: 100MΩ; Actuator/Cap Color: 黑色; Pin Style: SMD接片; Mechanical Life: 10万次; Operating Temperature: -30℃~+80℃
SW4 = 10*10*9-6P WX: 额定电流(DC)：10mA 额定电压(DC)：12V 电路结构：单刀五掷 机械寿命：50000 安装方式：SMD 工作温度：-10℃~+60℃ 开关长度：10mm 开关宽度：10mm 开关高度：9.1mm; Supplier Part: C2858290; Manufacturer: SHOU HAN(首韩); Supplier Footprint: SMD-6P,10x10mm; JLCPCB Part Class: 扩展库; Datasheet: https://atta.szlcsc.com/upload/public/pdf/source/20240424/64EDFF5ED40B20706A75A6A52414BAAA.pdf; Supplier: LCSC

## Nets
3V3: C4.1 C8.1 C8-1.2 C9.1 C9-1.2 C10.1 C11.1 C16.1 C22.1 L2.2 LED3.2(A) oled.4 R5.2 R7.1 R8.1 R11.1 R13.2 R14.2 R17.2 RT6150.1(VOUT) STLink.1 U1.24(VDD_1) U1.36(VDD_2) U1.48(VDD_3) U2.5(VCC) U4.8(VLOGIC) U4.13(VDD) U5.7(VDD) U5.15(VDD) U5.18(VDD)
GND: BAT1.2 C1.2 C1-1.1 C2.2 C2-1.1 C3.2 C3-1.1 C4.2 C4-1.1 C6-1.1 C7.2 C7-1.2 C8.2 C8-1.1 C9.2 C9-1.1 C10.2 C11.2 C12.2 C13.1 C14.1 C15.1 C16.2 C17.2 C18.2 C21.2 C22.2 oled.3 PROG0.1 R1.1 R2-1.2 R4.2 R6.1 R10.2 R15.1 R16.2 R18.2 RST0.2 RT6150.3(GND) RT6150.9(GND) RT6150.11(EXP) STLink.2 SW3.2 SW4.4 TP4056.1(TEMP) TP4056.3(GND) TP4056.9(EP) U1.8(VSSA) U1.23(VSS_1) U1.35(VSS_2) U1.47(VSS_3) U2.3(GND) U4.1(CLKIN) U4.9(AD0) U4.11(FSYNC) U4.18(GND) U5.8(VSS) U5.14(VSS) U5.17(VSS) U5.20(VSS) USB1.1(GND) USB1.12(GND) USB1.13(SHELL) USB1.14(SHELL) X1.2(GND) X1.4(GND)
VBAT_E: C18.1 U1.1(VBAT)
VCC_USB: C1.1 D2.1(A) LED1.2(A) LED2.2(A) Q1.1(G) R4.1 TP4056.4(VCC) TP4056.8(CE) USB1.2(VBUS) USB1.11(VBUS)
D+: U2.1(UD+) USB1.6(DP1) USB1.8(DP2)
D-: U2.2(UD-) USB1.5(DN2) USB1.7(DN1)
NRST: C17.1 R11.2 RST0.1 U1.7(NRST)
OSC_IN: C13.2 U1.5(PD0-OSC_IN) X1.1
OSC_OUT: C14.2 U1.6(PD1-OSC_OUT) X1.3
PA0: oled.2 R13.1 U1.10(PA0-WKUP)
PA1: oled.1 R14.1 U1.11(PA1)
PA6: SW3.1 U1.16(PA6)
PA7: SW4.1 U1.17(PA7)
PA8: U1.29(PA8) U5.1(CE)
PA13_DIO: STLink.4 U1.34(PA13)
PA14_CLK: STLink.3 U1.37(PA14)
PB0: SW4.5 U1.18(PB0)
PB1: SW4.6 U1.19(PB1)
PB5_INT1: U1.41(PB5) U4.12(INT)
PB6_SCL: R8.2 U1.42(PB6) U4.23(SCL)
PB7_SDA: R7.2 U1.43(PB7) U4.24(SDA)
PB10: SW4.2 U1.21(PB10)
PB11: SW4.3 U1.22(PB11)
PB12: U1.25(PB12) U5.2(CSN)
PB13: U1.26(PB13) U5.3(SCK)
PB14: U1.27(PB14) U5.5(MISO)
PB15: R17.1 U1.28(PB15) U5.4(MOSI)
RXD: U1.30(PA9) U2.7(RXD)
TXD: U1.31(PA10) U2.6(TXD)
$2N482: C1-1.2 R1-1.1 U5.9(XC2) X2.1(OSC1)
$2N774: C2-1.2 R1-1.2 U5.10(XC1) X2.2(OSC2)
$2N991: C3-1.2 C4-1.2 L1-1.2 L2-1.1 L2-1.2 U5.11(VDD_PA) U5.12(ANT1)
$2N1159: L1-1.1 L3-1.1 U5.13(ANT2)
$2N1334: C5-1.1 L3-1.2
$2N1338: C5-1.2 C6-1.2
$2N1439: R2-1.1 U5.16(IREF)
$2N1606: C7-1.1 U5.19(DVDD)
$4N1926: L1.2 RT6150.2(LX2)
$4N2095: R5.1 R6.2 RT6150.10(FB)
$4N5022: C7.1 U2.8(V3)
$4N10379: LED2.1(K) R3.2
$4N10382: LED1.1(K) R2.2
$4N10530: R3.1 TP4056.7(CHRG#)
$4N10534: R2.1 TP4056.6(STDBY#)
$4N10716: PROG0.2 TP4056.2(PROG)
$4N11756: BAT1.1 C2.1 Q1.3(D) TP4056.5(BAT)
$4N13991: C12.1 L2.1 U1.9(VDDA)
$4N14914: LED3.1(K) R10.1
$4N21597: L1.1 RT6150.4(LX1)
$4N22177: D2.2(K) Q1.2(S) SW1.2
$4N22183: C3.1 RT6150.5(VIN) RT6150.6(EN) RT6150.7(PS) RT6150.8(VINA) SW1.1
$4N34559: C15.2 U4.10(REGOUT)
$4N43151: C21.1 U4.20(CPOUT)
$4N98711: R15.2 U1.20(PB2)
$4N98765: R16.1 U1.44(BOOT0)
Net-(R1-2): R1.2 USB1.10(CC2)
Net-(R18-1): R18.1 USB1.4(CC1)

Not connected (* = marked no-connect by the designer): SW1 3*; U1 2(PC13-TAMPER-RTC)* 3(PC14-OSC32_IN)* 4(PC15-OSC32_OUT)* 12(PA2)* 13(PA3)* 14(PA4)* 15(PA5)* 32(PA11)* 33(PA12)* 38(PA15)* 39(PB3)* 40(PB4)* 45(PB8)* 46(PB9)*; U2 4(RTS#)*; U4 2(NC)* 3(NC)* 4(NC)* 5(NC)* 6(AUX_DA)* 7(AUX_CL)* 14(NC)* 15(NC)* 16(NC)* 17(NC)* 19(RESV)* 21(RESV)* 22(RESV)* 25(EP)*; U5 6(IRQ)* 21(EP)*; USB1 3(SBU2)* 9(SBU1)*

## Notes on the sheets
sheet 1
- 50ohm,RF I/O
sheet 3
- Reset_Button
- MPU6050
- 排针
- SWD
- 8Mhz
- 晶振
- STM32F103C8T6
- oled预留排针
- Power_LED
- Charger IC
- typec接口
- Power source selector
- 4.2V Li-ion in _ 3.3V DC out
- 充电器
- 变压器
- Type-C charge and serial

# Board PCB_Main
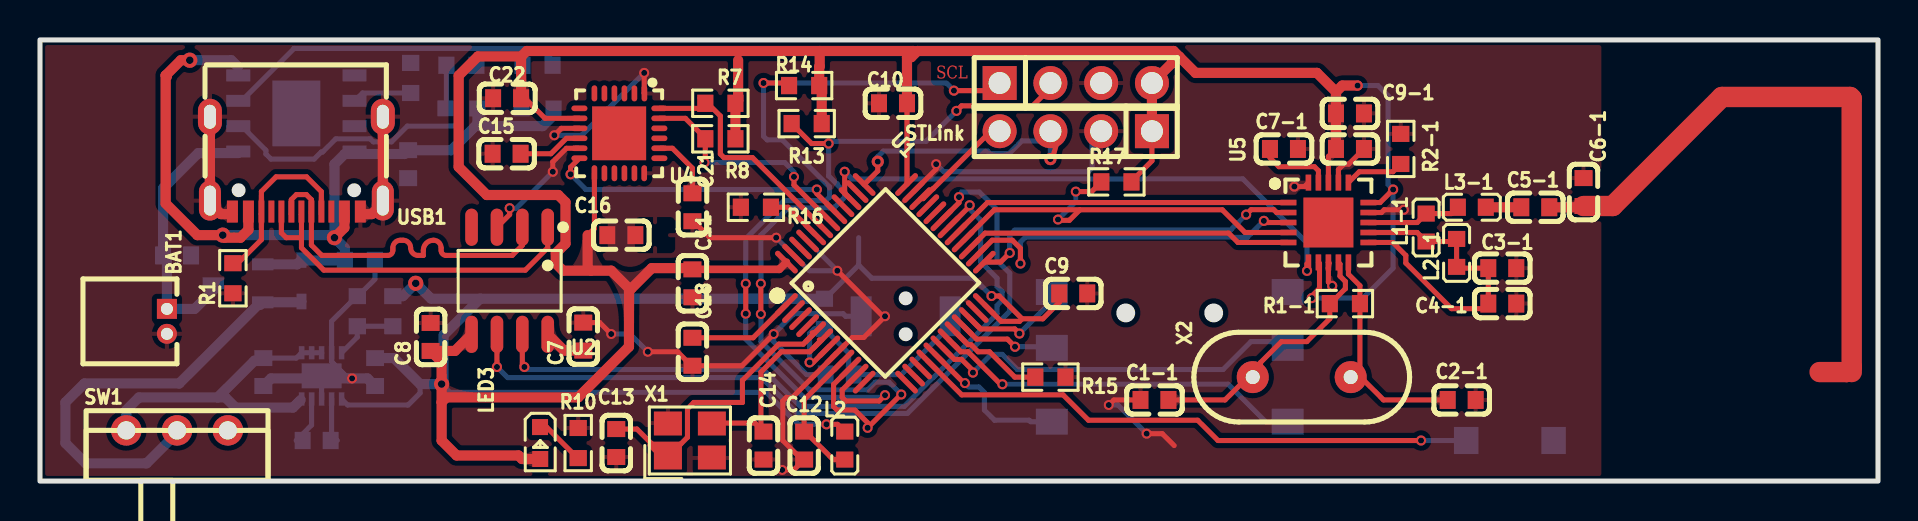
[diagram p3: board, top side]
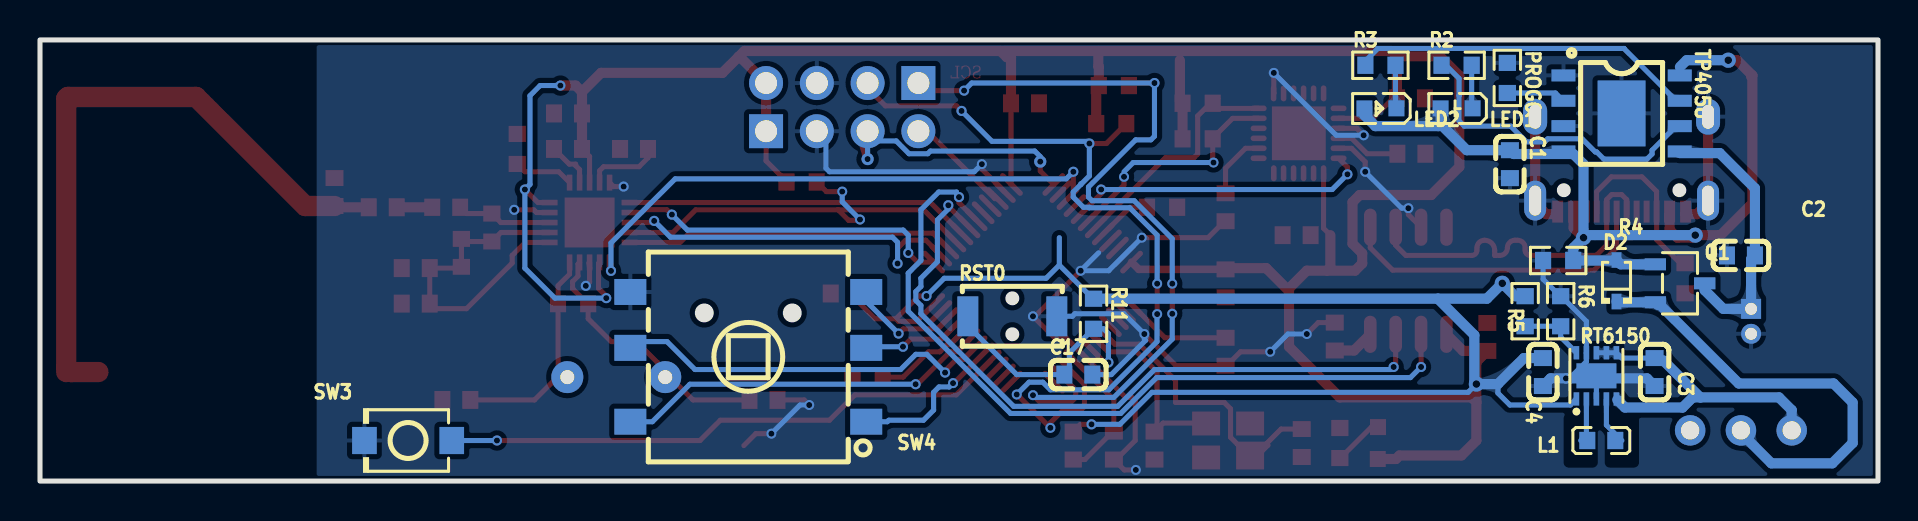
[diagram p4: board, bottom side, seen from below]

Outline 91.95 x 22.1 mm; copper layers: Top Layer, Bottom Layer. Coordinates in mm from the lower left corner of the outline.
Outline path: rectangle 0,22.1 91.95,0
Stack: Top Layer 0.035mm - / Dielectric1 1.51mm FR4 er 4.5 / Bottom Layer 0.035mm -

## Design rules (mm)
net D+: DP1
net D-: DP1
template: JLCPCB Capability(Two Layers Board)
spacing copperThickness1oz (default): track to track 0.102, other pairs 0.152 to 0.3
spacing copperThickness2oz: track to track 0.203, other pairs 0.152 to 0.3
track width copperThickness1oz (default): min 0.127, default 0.254, max 2.54
track width copperThickness2oz: min 0.203, default 0.254, max 2.54
differential pair differentialPair (default): width min 0.127, default 0.254, max 2.54; gap min 0.152, default 0.152
via viaSize (default): diameter min 0.5, default 0.61, max 10; hole min 0.3, default 0.305, max 6.3

## Placement (name value [footprint] x y rotation side)
BAT1  HC-1.25-2AW  [CONN-TH_2P-P1.25_HCTL_HC-1.25-2AW]  6.35 8 270 top
C1  10uF  [C0603]  18.42 15.88 270 bottom
C1-1  22pF  [C0603]  55.75 4.06 0 top
C2  10uF  [C0603]  6.86 11.3 0 bottom
C2-1  22pF  [C0603]  71.12 4.06 180 top
C3  10uF  [C0603]  11.18 5.46 270 bottom
C3-1  2.2nF  [C0603]  73.15 10.67 180 top
C4  22uF  [C0603]  16.76 5.46 270 bottom
C4-1  4.7pF  [C0603]  73.15 8.89 180 top
C5-1  1.5pF  [C0603]  74.8 13.72 0 top
C6-1  1pF  [C0603]  77.22 14.48 270 top
C7  100nF  [C0603]  27.18 7.24 90 top
C7-1  100nF  [C0603]  62.23 16.64 0 top
C8  100nF  [C0603]  19.54 7.22 90 top
C8-1  1nF  [C0603]  65.53 16.64 180 top
C9  100nF  [C0603]  51.69 9.4 0 top
C9-1  10nF  [C0603]  65.53 18.42 180 top
C10  100nF  [C0603]  42.67 18.92 180 top
C11  100nF  [C0603]  32.64 9.91 270 top
C12  100nF  [C0603]  38.23 1.78 270 top
C13  12pF  [C0603]  28.83 1.91 90 top
C14  12pF  [C0603]  36.19 1.78 90 top
C15  100nF  [C0603]  23.34 16.4 0 top
C16  100nF  [C0603]  29.08 12.32 0 top
C17  100nF  [C0603]  40 5.33 180 bottom
C18  100nF  [C0603]  32.64 6.48 270 top
C21  2.2uF  [C0603]  32.64 13.72 270 top
C22  10nF  [C0603]  23.37 19.18 180 top
D2  B5817WS  [SOD-323_L1.7-W1.3-LS2.5-FD]  13.08 10.03 270 bottom
L1  2.2uH  [L0603]  13.84 2.03 180 bottom
L1-1  8.2nH  [L0603]  69.34 12.7 270 top
L2  CBG160808U000T  [L0603]  40.26 1.78 90 top
L2-1  2.7nH  [L0603]  70.87 11.43 90 top
L3-1  3.9nH  [L0603]  71.63 13.72 0 top
LED1  NCD0603G1  [LED0603-RD_1]  21.08 18.67 0 bottom
LED2  NCD0603R1  [LED0603-RD_RED]  24.89 18.67 0 bottom
LED3  NCD0603R1  [LED0603-RD_RED]  25.02 1.91 270 top
oled  PZ254V-11-04P  [HDR-TH_4P-P2.54-V-M]  51.82 19.94 0 top
PROG0  4.7kΩ  [R0603]  18.54 20.19 270 bottom
Q1  CJ3401  [SOT-23-3_L2.9-W1.6-P1.90-LS2.8-BR]  9.91 9.91 0 bottom
R1  5.1kΩ  [R0603]  9.65 10.16 90 top
R1-1  1MΩ  [R0603]  65.28 8.89 0 top
R2  4.7kΩ  [R0603]  21.08 20.83 180 bottom
R2-1  22kΩ  [R0603]  68.07 16.64 90 top
R3  4.7kΩ  [R0603]  24.89 20.83 180 bottom
R4  10kΩ  [R0603]  16 11.05 0 bottom
R5  487kΩ  [R0603]  17.65 8.51 90 bottom
R6  86.6kΩ  [R0603]  15.88 8.51 270 bottom
R7  4.7kΩ  [R0603]  34.04 18.92 180 top
R8  4.7kΩ  [R0603]  34.04 17.14 180 top
R10  4.7kΩ  [R0603]  26.92 1.91 90 top
R11  10kΩ  [R0603]  39.24 8.38 270 bottom
R13  4.7kΩ  [R0603]  38.35 17.91 0 top
R14  4.7kΩ  [R0603]  38.23 19.81 0 top
R15  10kΩ  [R0603]  50.55 5.21 180 top
R16  10kΩ  [R0603]  35.81 13.72 180 top
R17  10kΩ  [R0603]  53.85 14.99 0 top
RST0  ZX-QC34-2TPDZ  [KEY-SMD_L3.9-W3.0-LS5.0-EH]  43.31 8.25 180 bottom
RT6150  RT6150BGQW  [WSON-10_L2.5-W2.5-P0.50-BL-EP]  14.09 5.27 180 bottom
STLink  PZ254V-11-04P  [HDR-TH_4P-P2.54-V-M]  51.82 17.53 180 top
SW1  TA-3522-A3  [SW-TH_3P-L9.1-W3.5-P2.50-A3]  6.86 2.54 0 top
SW3  TS-1088-AR02016  [SW-SMD_L3.9-W3.0-P4.45]  73.53 2.03 0 bottom
SW4  10*10*9-6P WX  [SW-SMD-6P-L10.5-W10.0_C2858290]  56.52 6.22 0 bottom
TP4056  TP4056-42-ESOP8  [ESOP-8_L4.9-W3.9-P1.27-LS6.0-BL-EP]  12.83 18.42 270 bottom
U1  STM32F103CBT6  [LQFP-48_L7.0-W7.0-P0.50-LS9.0-BL]  42.29 9.91 315 top
U2  CH340N  [SOP-8_L4.9-W3.9-P1.27-LS6.0-BL]  23.5 10.03 180 top
U4  MPU-6050  [QFN-24_L4.0-W4.0-P0.50-BL-EP2.7]  28.99 17.42 180 top
U5  NRF24L01P-R  [QFN-20_L4.0-W4.0-P0.50-BL-EP]  64.45 12.95 270 top
USB1  TYPE-C 16PIN 2MD(073)  [USB-C-SMD_TYPE-C-6PIN-2MD-073]  12.83 15.88 180 top
X1  8MHz  [CRYSTAL-SMD_4P-L3.2-W2.5-BL]  32.51 2.03 0 top
X2  16MHz  [OSC-TH_L10.0-W4.5-P5.00]  63.12 5.21 90 top

## Footprints (pads in the part's own frame, mm; a bottom-side part is the same pattern mirrored in y, then rotated)
C0603
  rect 0.8x0.9 smd: 1(-0.7,0) 2(0.7,0)
CONN-TH_2P-P1.25_HCTL_HC-1.25-2AW
  rect 1x1 hole 0.6: 1(-0.625,0)
  round 1 hole 0.6: 2(0.625,0)
CRYSTAL-SMD_4P-L3.2-W2.5-BL
  rect 1.4x1.2 smd: 1(-1.1,-0.85) 2(1.1,-0.85) 3(1.1,0.85) 4(-1.1,0.85)
ESOP-8_L4.9-W3.9-P1.27-LS6.0-BL-EP
  rect 0.6x1.2 smd: 1(-1.905,-2.909) 2(-0.635,-2.909) 3(0.635,-2.909) 4(1.905,-2.909) 5(1.905,2.909) 6(0.635,2.909) 7(-0.635,2.909) 8(-1.905,2.909)
  rect 3.3x2.4 smd: 9(0,0)
HDR-TH_4P-P2.54-V-M
  rect 1.7x1.7 hole 1.1: 1(-3.81,0)
  round 1.7 hole 1.1: 2(-1.27,0) 3(1.27,0) 4(3.81,0)
KEY-SMD_L3.9-W3.0-LS5.0-EH
  rect 1.05x2 smd: 1(-2.225,0) 2(2.225,0)
L0603
  rect 0.8x0.864 smd: 1(-0.7,0) 2(0.7,0)
LED0603-RD_1
  rect 0.8x0.8 smd: 1(-0.799,-0.004) 2(0.799,0.004)
LED0603-RD_RED
  rect 0.8x0.8 smd: 1(-0.799,-0.004) 2(0.799,0.004)
LQFP-48_L7.0-W7.0-P0.50-LS9.0-BL
  oval 0.27x1.5 smd: 1(-2.75,-4.25) 2(-2.25,-4.25) 3(-1.75,-4.25) 4(-1.25,-4.25) 5(-0.75,-4.25) 6(-0.25,-4.25) 7(0.25,-4.25) 8(0.75,-4.25) 9(1.25,-4.25) 10(1.75,-4.25) 11(2.25,-4.25) 12(2.75,-4.25) 25(2.75,4.25) 26(2.25,4.25) 27(1.75,4.25) 28(1.25,4.25) 29(0.75,4.25) 30(0.25,4.25) 31(-0.25,4.25) 32(-0.75,4.25) 33(-1.25,4.25) 34(-1.75,4.25) 35(-2.25,4.25) 36(-2.75,4.25)
  oval 1.5x0.27 smd: 13(4.25,-2.75) 14(4.25,-2.25) 15(4.25,-1.75) 16(4.25,-1.25) 17(4.25,-0.75) 18(4.25,-0.25) 19(4.25,0.25) 20(4.25,0.75) 21(4.25,1.25) 22(4.25,1.75) 23(4.25,2.25) 24(4.25,2.75) 37(-4.25,2.75) 38(-4.25,2.25) 39(-4.25,1.75) 40(-4.25,1.25) 41(-4.25,0.75) 42(-4.25,0.25) 43(-4.25,-0.25) 44(-4.25,-0.75) 45(-4.25,-1.25) 46(-4.25,-1.75) 47(-4.25,-2.25) 48(-4.25,-2.75)
OSC-TH_L10.0-W4.5-P5.00
  round 1.6 hole 0.7: 1(0,2.45) 2(0,-2.45)
QFN-20_L4.0-W4.0-P0.50-BL-EP
  rect 0.28x0.8 smd: 1(-1,-2) 2(-0.5,-2) 3(0,-2) 4(0.5,-2) 5(1,-2) 11(1,2) 12(0.5,2) 13(0,2) 14(-0.5,2) 15(-1,2)
  rect 0.8x0.28 smd: 6(2,-1) 7(2,-0.5) 8(2,0) 9(2,0.5) 10(2,1) 16(-2,1) 17(-2,0.5) 18(-2,0) 19(-2,-0.5) 20(-2,-1)
  rect 2.5x2.5 smd: 21(0,0)
QFN-24_L4.0-W4.0-P0.50-BL-EP2.7
  oval 0.28x0.8 smd: 1(-1.25,-2) 2(-0.75,-2) 3(-0.25,-2) 4(0.25,-2) 5(0.75,-2) 6(1.25,-2) 13(1.25,2) 14(0.75,2) 15(0.25,2) 16(-0.25,2) 17(-0.75,2) 18(-1.242,2)
  oval 0.8x0.28 smd: 7(2,-1.25) 8(2,-0.75) 9(2,-0.25) 10(2,0.25) 11(2,0.75) 12(2,1.25) 19(-2,1.25) 20(-2,0.75) 21(-2,0.25) 22(-2,-0.25) 23(-2,-0.75) 24(-2,-1.25)
  rect 2.7x2.7 smd: 25(0.013,0)
R0603
  rect 0.806x0.864 smd: 1(-0.753,0) 2(0.753,0)
SOD-323_L1.7-W1.3-LS2.5-FD
  rect 0.78x0.5 smd: 1(-1.04,0) 2(1.04,0)
SOP-8_L4.9-W3.9-P1.27-LS6.0-BL
  oval 0.63x1.865 smd: 1(-1.905,-2.683) 2(-0.635,-2.683) 3(0.635,-2.683) 4(1.905,-2.683) 5(1.905,2.683) 6(0.635,2.683) 7(-0.635,2.683) 8(-1.905,2.683)
SOT-23-3_L2.9-W1.6-P1.90-LS2.8-BR
  rect 1.07x0.6 smd: 1(1.235,-0.95) 2(1.235,0.95) 3(-1.235,0)
SW-SMD-6P-L10.5-W10.0_C2858290
  rect 1.6x1.3 smd: 1(-5.9,3.25) 2(-5.9,-0.45) 3(-5.9,-3.25) 4(5.9,-3.25) 5(5.9,-0.45) 6(5.9,3.25)
SW-SMD_L3.9-W3.0-P4.45
  rect 1.23x1.36 smd: 1(-2.185,0) 2(2.185,0)
SW-TH_3P-L9.1-W3.5-P2.50-A3
  round 1.524 hole 0.914: 1(-2.54,0) 2(0,0) 3(2.54,0)
USB-C-SMD_TYPE-C-6PIN-2MD-073
  rect 0.55x1.1 smd: 1(-3.2,2.375) 2(-2.4,2.375) 11(2.4,2.375) 12(3.2,2.375)
  rect 0.3x1.1 smd: 3(-1.75,2.375) 4(-1.25,2.375) 5(-0.75,2.375) 6(-0.25,2.375) 7(0.25,2.375) 8(0.75,2.375) 9(1.25,2.375) 10(1.75,2.375)
  oval 1.1x2 hole 0.6x1.5: 13(-4.325,1.825) 14(4.325,1.825)
  oval 1.2x1.8 hole 0.6x1.2: 13(-4.325,-2.375) 14(4.325,-2.375)
WSON-10_L2.5-W2.5-P0.50-BL-EP
  rect 0.28x0.665 smd: 1(-1,-1.157) 2(-0.5,-1.157) 3(0,-1.157) 4(0.5,-1.157) 5(1,-1.157) 6(1,1.157) 7(0.5,1.157) 8(0,1.157) 9(-0.5,1.157) 10(-1,1.157)
  rect 2x1.25 smd: 11(0,0)

## Nets
As in the schematic, except:
$4N9764: R1.2 USB1.4 USB1.10

Pads without a net: SW1 3; U1 2 3 4 12 13 14 15 32 33 38 39 40 45 46; U2 4; U4 2 3 4 5 6 7 14 15 16 17 19 21 22 25; U5 6 21; USB1 3 9

## Via types
v1: diameter 0.508, hole 0.305, Top Layer to Bottom Layer, 33 vias
v2: diameter 0.5, hole 0.305, Top Layer to Bottom Layer, 24 vias
v3: diameter 0.762, hole 0.381, Top Layer to Bottom Layer, 5 vias
v4: diameter 0.61, hole 0.305, Top Layer to Bottom Layer, 2 vias

## Routing (per net, layer and track width the routed paths; a pad name or vN(x,y) marks a point on that pad's centre or on a via; arc(x,y) is an arc through that point)
3V3: length 230
  Top Layer w0.254: C9.1 50.99,8.95 50.16,8.13 49.13,8.13 ; 43.35,14.86 43.37,14.88 C10.1 ; C8-1.2 64.45,16.26 U5.18 ; U5.15 67.04,13.95 v1(67.69,14.61) ; 47.24,8.85 48.09,8 49,8 49.13,8.13 ; v1(39.34,2.84) 39.9,2.84 L2.2 ; U5.7 64.01,10.9 64.01,9.65 63.62,9.27 v1(63.62,9.16) ; 27.4,12.32 27.74,12.66 U4.13 ; R17.2 54.6,15.02 55.63,16.04 STLink.1 ; v1(47.6,9.27) 47.99,9.27 49.13,8.13 ; U4.8 25.26,18.17 24.26,19.18 C22.1
  Top Layer w0.381: 37.34,10.97 36.98,10.61 C11.1
  Top Layer w0.508: 27.56,10.54 28.58,10.54 29.46,9.65 ; 27.56,10.54 27.4,10.7 27.4,12.32 ; 27.56,10.54 26.16,10.54 25.8,10.9 25.8,11.41 26.29,11.89 26.29,13.97 25.93,14.33 22.35,14.33 20.94,15.74 20.94,20.31 21.91,21.27 24.08,21.27 ; STLink.1 oled.4 56.94,21.25 57,21.25 ; 39.01,21.54 24.35,21.54 24.08,21.27 ; 39.01,21.54 43.68,21.54 43.37,21.23 ; 39.01,21.54 39.01,20.78 38.98,20.75 R14.2 39.11,19.69 R13.2 ; 20.09,3.95 20.33,4.19 26.92,4.19 29.46,6.73 29.46,9.65 ; 20.09,3.95 v3(20.09,4.86) 20.09,5.97 C8.1 20.76,6.52 U2.5 ; 20.09,3.95 20.09,2.03 20.84,1.28 23.94,1.28 24.11,1.11 LED3.2 ; 34.93,21.08 34.93,19.06 R7.1 R8.1 ; v1(65.91,19.81) 65.15,19.81 64.83,19.5 ; 29.46,9.65 29.59,9.65 30.61,10.67 32.58,10.67 C11.1 ; 57,21.25 57.81,20.45 63.88,20.45 64.83,19.5 ; 57,21.25 56.71,21.54 43.9,21.54 43.59,21.23 43.37,21.23 ; 64.83,19.5 C9-1.2 C8-1.2 ; 43.37,21.23 C10.1 ; 24.08,21.27 24.07,21.26 C22.1
  Bottom Layer w0.254: v3(20.09,4.86) 20.51,4.44 36.32,4.44 37.93,2.84 v1(39.34,2.84) ; v1(65.91,19.81) 66.93,19.81 67.44,19.3 67.44,14.86 v1(67.69,14.61) 67.69,10.67 66.19,9.16 v1(63.62,9.16) ; 19.02,4.86 19.02,4.41 18.42,3.81 15.39,3.81 RT6150.1 ; 39.27,9.14 40.96,10.82 ; 40.96,10.82 40.96,12.19 ; 40.96,10.82 41.61,10.16 46.71,10.16 v1(47.6,9.27)
  Bottom Layer w0.508: R5.2 18.15,9.26 v3(18.8,9.91) 19.57,9.14 22.02,9.14 ; C4.1 17.72,6.16 19.02,4.86 v3(20.09,4.86) 20.19,4.96 20.19,7.31 22.02,9.14 ; 22.02,9.14 39.24,9.14
GND: length 108.4
  Top Layer w0.254: v1(62.75,14.75) 63.25,14.75 U5.20 ; 64.45,10.67 U5.8 64.49,10.92 64.45,10.67 ; 64.45,10.67 64.45,9.97 v1(64.64,9.78) ; C21.2 32.69,13.02 33.51,12.19 v2(36.83,12.19) ; U4.11 26.34,16.67 25.81,16.15 ; 25.78,16.12 25.65,15.99 v1(25.65,15.49) ; 56.74,1.78 56.14,2.37 v2(55.36,2.37) ; U4.1 30.23,19.43 v2(30.23,20.45) ; C7.2 28,7.94 v2(28.58,7.37) ; U5.14 67.11,13.45 67.25,13.59 v1(68.22,13.59) ; v2(44.83,15.88) 44.83,15.63 43.71,14.5 ; v2(37.13,0.56) 37.71,0.56 C12.2 38.11,1.08 37.16,2.03 37.16,4.01 37.34,4.19 37.64,4.19 U1.8 40.64,7.19 41.21,7.19 v2(42.27,8.25) 42.17,8.25 v2(39.89,10.54) ; v2(53.47,3.81) 53.72,4.06 C1-1.1 ; U2.3 23.5,13.35 v2(23.5,13.67) ; v1(25.73,17.32) 26.08,17.67 U4.9 ; C8-1.1 65.47,15.88 65.15,15.88 65.15,15.8 64.95,15.6 U5.17 ; v2(30.41,6.48) 31.89,6.48 32.59,5.78 C18.2 35.11,5.78 v2(36.7,7.37)
  Top Layer w0.508: 16.03,13.37 16.6,13.37 17.15,13.92 17.15,18.12 ; 9.63,13.37 9.05,13.37 8.5,13.92 8.5,18.12
  Bottom Layer w0.254: v2(30.23,20.45) 27.1,17.32 v1(25.73,17.32) ; RST0.2 40.3,8.25 40.18,8.38 37.72,8.38 v2(36.7,7.37) 36.7,7.11 36.64,7.05 38.35,5.33 C17.2 ; v2(30.41,6.48) 29.52,7.37 v2(28.58,7.37) ; R4.2 16.76,10.11 15.9,9.26 R6.1 15.85,9.26 14.59,8 RT6150.9 14.59,5.99 15.43,5.14 ; v2(55.36,2.37) 53.93,3.81 v2(53.47,3.81) ; v2(23.5,13.67) 23.83,13.67 v1(25.65,15.49) ; v2(44.83,15.88) 45.21,15.49 52.45,15.49 52.63,15.67 52.63,17.07 STLink.2 ; v2(36.83,12.19) 38.49,10.54 v2(39.89,10.54) 39.89,10.54 38.99,11.44 ; 14.22,5.14 RT6150.11 RT6150.3
  Bottom Layer w0.508: C3.2 11.56,5.14 v1(15.61,5.14) 16.38,5.14 C4.2
VBAT_E: length 5.4
  Top Layer w0.254: C18.1 35.67,7.18 37.34,8.85
VCC_USB: length 46
  Top Layer w0.508: 6.29,20.32 7.05,21.08 v3(7.49,21.08) ; 6.29,20.32 6.29,13.91 7.87,12.32 v3(9.14,12.32) 9.27,12.19 10.03,12.19 10.43,12.59 10.43,13.37 ; 6.29,20.32 6.35,20.26 ; USB1.2 15.23,12.69 v3(14.73,12.19)
  Bottom Layer w0.508: v3(14.73,12.19) 14.61,12.32 v3(9.14,12.32) ; v3(14.73,12.19) 14.73,15.88 15.24,16.38 18.22,16.38 C1.1 20.57,16.58 21.88,17.88 ; v3(14.73,12.19) 15.25,11.68 R4.1 13.11,11.05 D2.1 12.86,10.86 11.14,10.86 ; v3(7.49,21.08) 9.57,21.08 9.91,20.75 ; 21.88,17.88 21.98,17.78 25.15,17.78 25.69,18.33 LED2.2 ; 21.88,17.88 LED1.2
(no net): length 27.9
  Top Layer w0.254: U5.6 63.38,10.88 v1(63.38,10.53) ; U1.39 40.25,14.42 v1(40.25,15.49)
  Bottom Layer w0.254: v1(63.38,10.53) 63.38,11.93 60.17,15.14 40.61,15.14 v1(40.25,15.49)
D+: length 18
  Top Layer w0.254: 13.08,12.19 13.08,11.68 14.2,10.57 24.28,10.57 25.4,11.69 U2.1 ; 13.08,12.19 12.32,12.19 12.08,12.43 12.08,13.37 ; 13.08,12.19 13.08,13.37 13.08,13.37
D-: length 18.2
  Top Layer w0.254: 12.58,13.37 12.57,13.38 12.57,14.1 12.83,14.35 13.32,14.35 13.58,14.1 13.58,13.37 ; USB1.5 13.58,11.82 14.1,11.3 17.4,11.3 arc(17.58,11.38) 17.65,11.56 17.65,11.68 arc(17.76,11.95) 18.03,12.06 18.16,12.06 arc(18.43,11.95) 18.54,11.68 arc(18.65,11.41) 18.92,11.3 19.18,11.3 19.18,11.56 arc(19.33,11.92) 19.69,12.06 arc(19.95,11.95) 20.07,11.68 20.07,11.56 arc(20.14,11.38) 20.32,11.3 23.62,11.3 24.13,11.81 U2.2
NRST: length 12.9
  Top Layer w0.254: v1(38.5,5.94) 38.68,5.94 U1.7
  Bottom Layer w0.254: v1(38.5,5.94) 38.5,7.38 38.74,7.63 R11.2 40.45,6.42 40.45,5.33 43.09,5.33 45.53,7.78 RST0.1
OSC_IN: length 16.4
  Top Layer w0.254: C13.2 29.86,2.61 30.62,1.85 ; 30.62,1.85 32.05,1.85 32.39,2.19 32.39,3.62 32.71,3.94 35.14,3.94 35.14,5.04 36.96,6.86 38.18,6.86 U1.5 38.63,7.43 ; 30.62,1.85 31.31,1.16 ; 30.62,1.85 30.58,1.85 30.52,1.79 31.16,1.16 31.31,1.16 ; 31.41,1.16 31.31,1.16
OSC_OUT: length 9.4
  Top Layer w0.254: 38.99,7.08 39.11,7.08 38.51,6.48 37.08,6.48 36.07,5.46 36.07,2.61 ; 36.07,2.61 C14.2 ; 36.07,2.61 35.77,2.91 33.61,2.91
PA0: length 43.3
  Top Layer w0.254: v1(39.45,16.91) 38.6,16.91 R13.1 ; v2(43.09,4.34) 43.07,4.34 v2(41.4,2.67) 41.4,2.92 40.77,3.56 39.88,3.56 39.7,3.73 39.7,4.84 U1.10 ; v2(36.06,9.89) v2(36.06,8.36) ; oled.2 50.55,19.69 49.66,18.8 46.1,18.8 v1(45.85,18.54)
  Bottom Layer w0.254: v2(36.06,9.89) 36.06,12.32 37.43,13.69 39.47,13.69 39.46,13.72 39.75,13.72 40.26,14.22 40.26,14.48 39.88,14.86 ; v2(43.09,4.34) 42.47,4.95 41.78,4.95 41.4,4.57 38.48,4.57 36.07,6.98 36.07,8.13 ; 39.88,14.86 39.45,15.29 v1(39.45,16.91) 39.56,17.02 44.32,17.02 v1(45.85,18.54) ; 39.88,14.86 39.88,14.9
PA1: length 43.1
  Top Layer w0.254: v1(45.72,19.56) 47.62,19.56 oled.1 ; U1.11 40.13,4.56 40.13,4.19 40.31,4.01 41.98,4.01 v2(42.27,4.3) ; v1(36.19,19.94) 37.35,19.94 R14.1 ; v2(35.31,9.89) v2(35.31,8.38)
  Bottom Layer w0.254: v2(35.31,9.89) 35.31,12.14 37.21,14.04 39.32,14.04 39.5,14.22 39.5,14.73 37.14,17.09 36.38,17.09 36.19,17.27 v1(36.19,19.94) 45.34,19.94 v1(45.72,19.56) ; v2(42.27,4.3) 42.16,4.19 38.23,4.19 35.31,7.11 v2(35.31,8.38)
PA6: length 28.6
  Top Layer w0.254: U1.16 46.11,4.32 51.18,4.32 52.45,3.05 57.91,3.05 58.93,2.03 v1(69.09,2.03)
  Bottom Layer w0.254: SW3.1 v1(69.09,2.03)
PA7: length 7.8
  Top Layer w0.254: v2(46.27,4.91) 46.23,4.91 U1.17
  Bottom Layer w0.254: SW4.1 49.56,2.97 49.49,3.05 47.75,3.05 47.24,3.56 47.24,4.44 46.97,4.71 46.46,4.71 v2(46.27,4.91)
PA8: length 17.3
  Top Layer w0.254: U1.29 47.4,13.95 U5.1
PA13_DIO: length 5.7
  Top Layer w0.254: U1.34 44.18,14.15 44.68,14.64 44.68,14.64 48.13,18.1
PA14_CLK: length 12.7
  Top Layer w0.254: U1.37 41.91,15.54 v4(41.91,16) ; 50.93,17.14 50.67,16.26 v4(50.55,16.13)
  Bottom Layer w0.254: v4(50.55,16.13) 50.55,16.89 50.4,17.04 49.12,17.04 48.47,16.4 47.54,16.4 47.4,16.53 42.19,16.53 41.91,16.26 v4(41.91,16)
PB0: length 19.3
  Top Layer w0.254: U1.18 45.75,6.1 46.11,6.1 46.67,5.53 v1(46.67,5.43)
  Bottom Layer w0.254: SW4.5 62.1,6.98 60.58,6.98 59.18,5.59 48.9,5.59 48.13,6.35 47.59,6.35 v1(46.67,5.43)
PB1: length 18.6
  Top Layer w0.254: U1.19 45.47,7.07 46.07,6.48 46.43,6.48 48.05,4.85 v1(48.15,4.85)
  Bottom Layer w0.254: v1(48.15,4.85) 59.44,4.85 61.31,2.97 SW4.6
PB5_INT1: length 15.2
  Top Layer w0.254: U4.12 26.54,15.73 v1(26.54,15.37) ; v1(38.86,14.61) 38.86,14.4 U1.41
  Bottom Layer w0.254: v1(38.86,14.61) 27.31,14.61 v1(26.54,15.37)
PB6_SCL: length 11.5
  Top Layer w0.254: U4.23 32.29,18.17 33.28,17.17 R8.2 33.28,16 v2(33.24,15.96) ; U1.42 37.72,14.83 v2(37.72,15.24)
  Bottom Layer w0.254: 37.72,15.49 37.26,15.96 v2(33.24,15.96)
PB7_SDA: length 12.3
  Top Layer w0.254: R7.2 33.03,18.67 U4.24 ; R7.2 33.02,19.19 ; R7.2 33.4,18.92 34.04,18.29 34.04,16.38 34.22,16.2 35.64,16.2 39.11,12.73
PB10: length 4.9
  Top Layer w0.254: v1(48.78,6.73) 48.39,7.11 46.85,7.11 U1.21
  Bottom Layer w0.254: SW4.2 50.56,6.73 v1(48.78,6.73)
PB11: length 5.5
  Top Layer w0.254: v1(49,7.39) 48.77,7.62 47.05,7.62 U1.22
  Bottom Layer w0.254: SW4.3 50.62,9.01 v1(49,7.39)
PB12: length 16.9
  Top Layer w0.254: U1.25 48.05,10.97 v1(48.51,11.43) ; v1(60.34,13.35) 60.59,13.6 61.72,13.6 61.87,13.45 U5.2
  Bottom Layer w0.254: v1(48.51,11.43) 48.51,12.32 48.77,12.57 59.56,12.57 v1(60.34,13.35)
PB13: length 18.3
  Top Layer w0.254: v1(49.05,10.9) 49.05,11.66 48.64,12.06 47.63,12.06 U1.26 ; U5.3 61.31,12.95 v1(61.22,13.03)
  Bottom Layer w0.254: v1(61.22,13.03) 60.41,12.22 49.3,12.22 49.05,11.96 v1(49.05,10.9)
PB14: length 16.4
  Top Layer w0.254: U1.27 47.28,12.42 59.46,12.42 59.93,11.95 U5.5
PB15: length 22
  Top Layer w0.254: 52.02,13.59 51.49,13.06 50.97,13.06 v2(50.93,13.1) ; 52.02,13.59 47.74,13.59 U1.28 ; 52.02,13.59 59.14,13.59 60.28,12.45 U5.4 ; R17.1 52.61,14.5 v2(51.82,14.5)
  Bottom Layer w0.254: v2(50.93,13.1) 51.82,13.99 v2(51.82,14.5)
RXD: length 35.8
  Top Layer w0.254: U1.30 46.51,13.77 v1(46.51,13.82) ; U2.7 24.13,5.82 v1(24.23,5.72)
  Bottom Layer w0.254: v1(46.51,13.82) 46.51,13.63 47.05,13.08 47.05,10.99 47.88,10.16 47.88,9.75 48.13,9.49 48.13,9.05 47.88,8.8 47.88,8.38 43.24,3.74 38.04,3.74 36.19,5.59 24.36,5.59 v1(24.23,5.72)
TXD: length 39.7
  Top Layer w0.254: v1(45.97,14.22) 45.97,13.94 U1.31 ; U2.6 v1(22.86,5.72)
  Bottom Layer w0.254: 45.92,14.22 46.1,14.4 46.1,14.48 46.99,14.48 47.88,13.59 47.88,11.05 48.51,10.41 48.51,8.51 43.39,3.39 37.88,3.39 36.09,5.18 23.39,5.18 v1(22.86,5.72)
$2N482: length 13
  Top Layer w0.25: 65.29,9.63 64.55,8.89 R1-1.1 64.53,8.14 63.37,6.98 62.1,6.98 61.06,5.94 61.06,5.59
  Top Layer w0.254: 65.29,9.63 65.3,9.64 65.3,10 65.03,10.27 65.03,10.87 U5.9 ; 60.81,5.59 59.28,4.06 C1-1.2
$2N774: length 11
  Top Layer w0.25: 65.94,5.59 66.03,5.68 R1-1.2 66.03,9.79 65.45,10.37 U5.10
  Top Layer w0.254: C2-1.2 67.21,4.06 65.69,5.59
$2N991: length 17.3
  Top Layer w0.254: U5.11 67.68,11.95 68.33,11.3 68.33,10.92 70.61,8.64 72.33,8.64 72.58,8.89 ; U5.12 68.89,12.45 L1-1.2 70.74,12 L2-1.2 L2-1.1 70.93,10.67 C3-1.2 C4-1.2
$2N1159: length 4.8
  Top Layer w0.254: U5.13 68.89,12.95 L1-1.1 70.61,13.4 L3-1.1
$2N1334: length 1.8
  Top Layer w0.508: L3-1.2 C5-1.1
$2N1338: length 32.9
  Top Layer w0.508: C6-1.2 77.15,13.72 C5-1.2
  Top Layer w1.016: 90.63,5.72 90.38,5.46 89.03,5.46 ; 90.63,5.72 90.63,19.16 90.55,19.24 84.14,19.24 78.68,13.78 C6-1.2 ; 90.63,5.72 90.63,5.46
$2N1439: length 3
  Top Layer w0.25: R2-1.1 67.68,15.49 66,15.49 U5.16
$2N1606: length 3.7
  Top Layer w0.25: C7-1.1 61.53,16.19 61.98,15.75 63.75,15.75 63.95,15.55 U5.19
$4N1926: length 2.2
  Bottom Layer w0.254: 14.87,2.03 14.59,2.31 RT6150.2
$4N2095: length 3.4
  Bottom Layer w0.254: RT6150.10 15.88,7.22 R6.2 R5.1
$4N5022: length 2.1
  Top Layer w0.508: U2.8 26.21,6.54 C7.1
$4N9764: length 9.1
  Top Layer w0.254: 14.08,13.37 14.08,14.5 13.34,15.24 11.81,15.24 11.08,14.51 11.08,12.09 9.9,10.91 R1.2
$4N10379: length 2.2
  Bottom Layer w0.254: LED2.1 24.14,18.72 R3.2
$4N10382: length 2.2
  Bottom Layer w0.254: LED1.1 20.33,18.72 R2.2
$4N10530: length 17.3
  Bottom Layer w0.254: R3.1 25.65,21.04 25.02,21.67 12.71,21.67 12.7,21.66 12.7,21.66 10.22,19.18 10.05,19.18 TP4056.7
$4N10534: length 16
  Bottom Layer w0.254: TP4056.6 10.09,17.78 11.3,16.57 11.3,16.38 11.56,16.13 13.72,16.13 14.07,16.49 14.14,16.49 14.8,17.14 16.52,17.14 16.67,16.99 17.59,16.99 18.38,17.78 20.7,17.78 20.96,18.04 20.96,19.31 20.95,19.32 20.95,20.17 21.62,20.83 R2.1
$4N10716: length 3
  Bottom Layer w0.254: PROG0.2 16.14,19.44 15.73,19.03 15.73,18.97
$4N11756: length 13.7
  Bottom Layer w0.508: 9.91,16.43 7.92,16.43 6.16,14.67 C2.1 6.35,11.11 BAT1.1 7.74,8.63 8.67,9.56 Q1.3
$4N13991: length 7
  Top Layer w0.254: U1.9 38.23,4.07 C12.1 38.28,2.48 39.68,1.08 L2.1
$4N14914: length 2.6
  Top Layer w0.254: R10.1 26.9,1.15 25.34,2.7 25.02,2.7
$4N21597: length 2.4
  Bottom Layer w0.254: 12.82,2.03 13.59,2.81 RT6150.4
$4N22177: length 22.7
  Bottom Layer w0.508: SW1.2 6.86,2.41 5.33,0.89 2.29,0.89 1.27,1.91 1.27,3.94 2.22,4.89 6.97,4.89 10.91,8.83 11.01,8.83 11.14,8.96 13.04,8.96 D2.2
$4N22183: length 16.4
  Bottom Layer w0.254: RT6150.8 RT6150.7 RT6150.6 12.82,6.16 C3.1
  Bottom Layer w0.508: SW1.1 4.32,3.56 4.95,4.19 8.89,4.19 ; 8.89,4.19 9.27,4.19 9.78,3.68 12.66,3.68 13.04,4.07 ; 8.89,4.19 10.73,6.03 11.18,6.03
$4N34559: length 3.3
  Top Layer w0.254: U4.10 26.33,17.17 25.56,16.4 C15.2
$4N43151: length 3.3
  Top Layer w0.254: U4.20 31.64,16.67 32.64,15.67 C21.1
$4N98711: length 4.9
  Top Layer w0.254: R15.2 48.77,5.21 47.5,6.48 46.93,6.48 46.58,6.83 46.43,6.83 U1.20
$4N98765: length 2.7
  Top Layer w0.254: R16.1 37.42,13.72 U1.44

## Copper pours and planes (outline as drawn; the poured copper is in the pictures)
GND on Top Layer: -3.56,24.77 78.11,24.77 78.11,-3.3 -3.56,-3.3
GND on Bottom Layer: -3.05,23.37 78.11,23.37 78.11,-1.65 -3.05,-1.65

Small or netless copper shapes (teardrops, artwork), in the pictures only: 61 on Top Layer, 43 on Bottom Layer

## Text on the board
Top Layer: SCL
